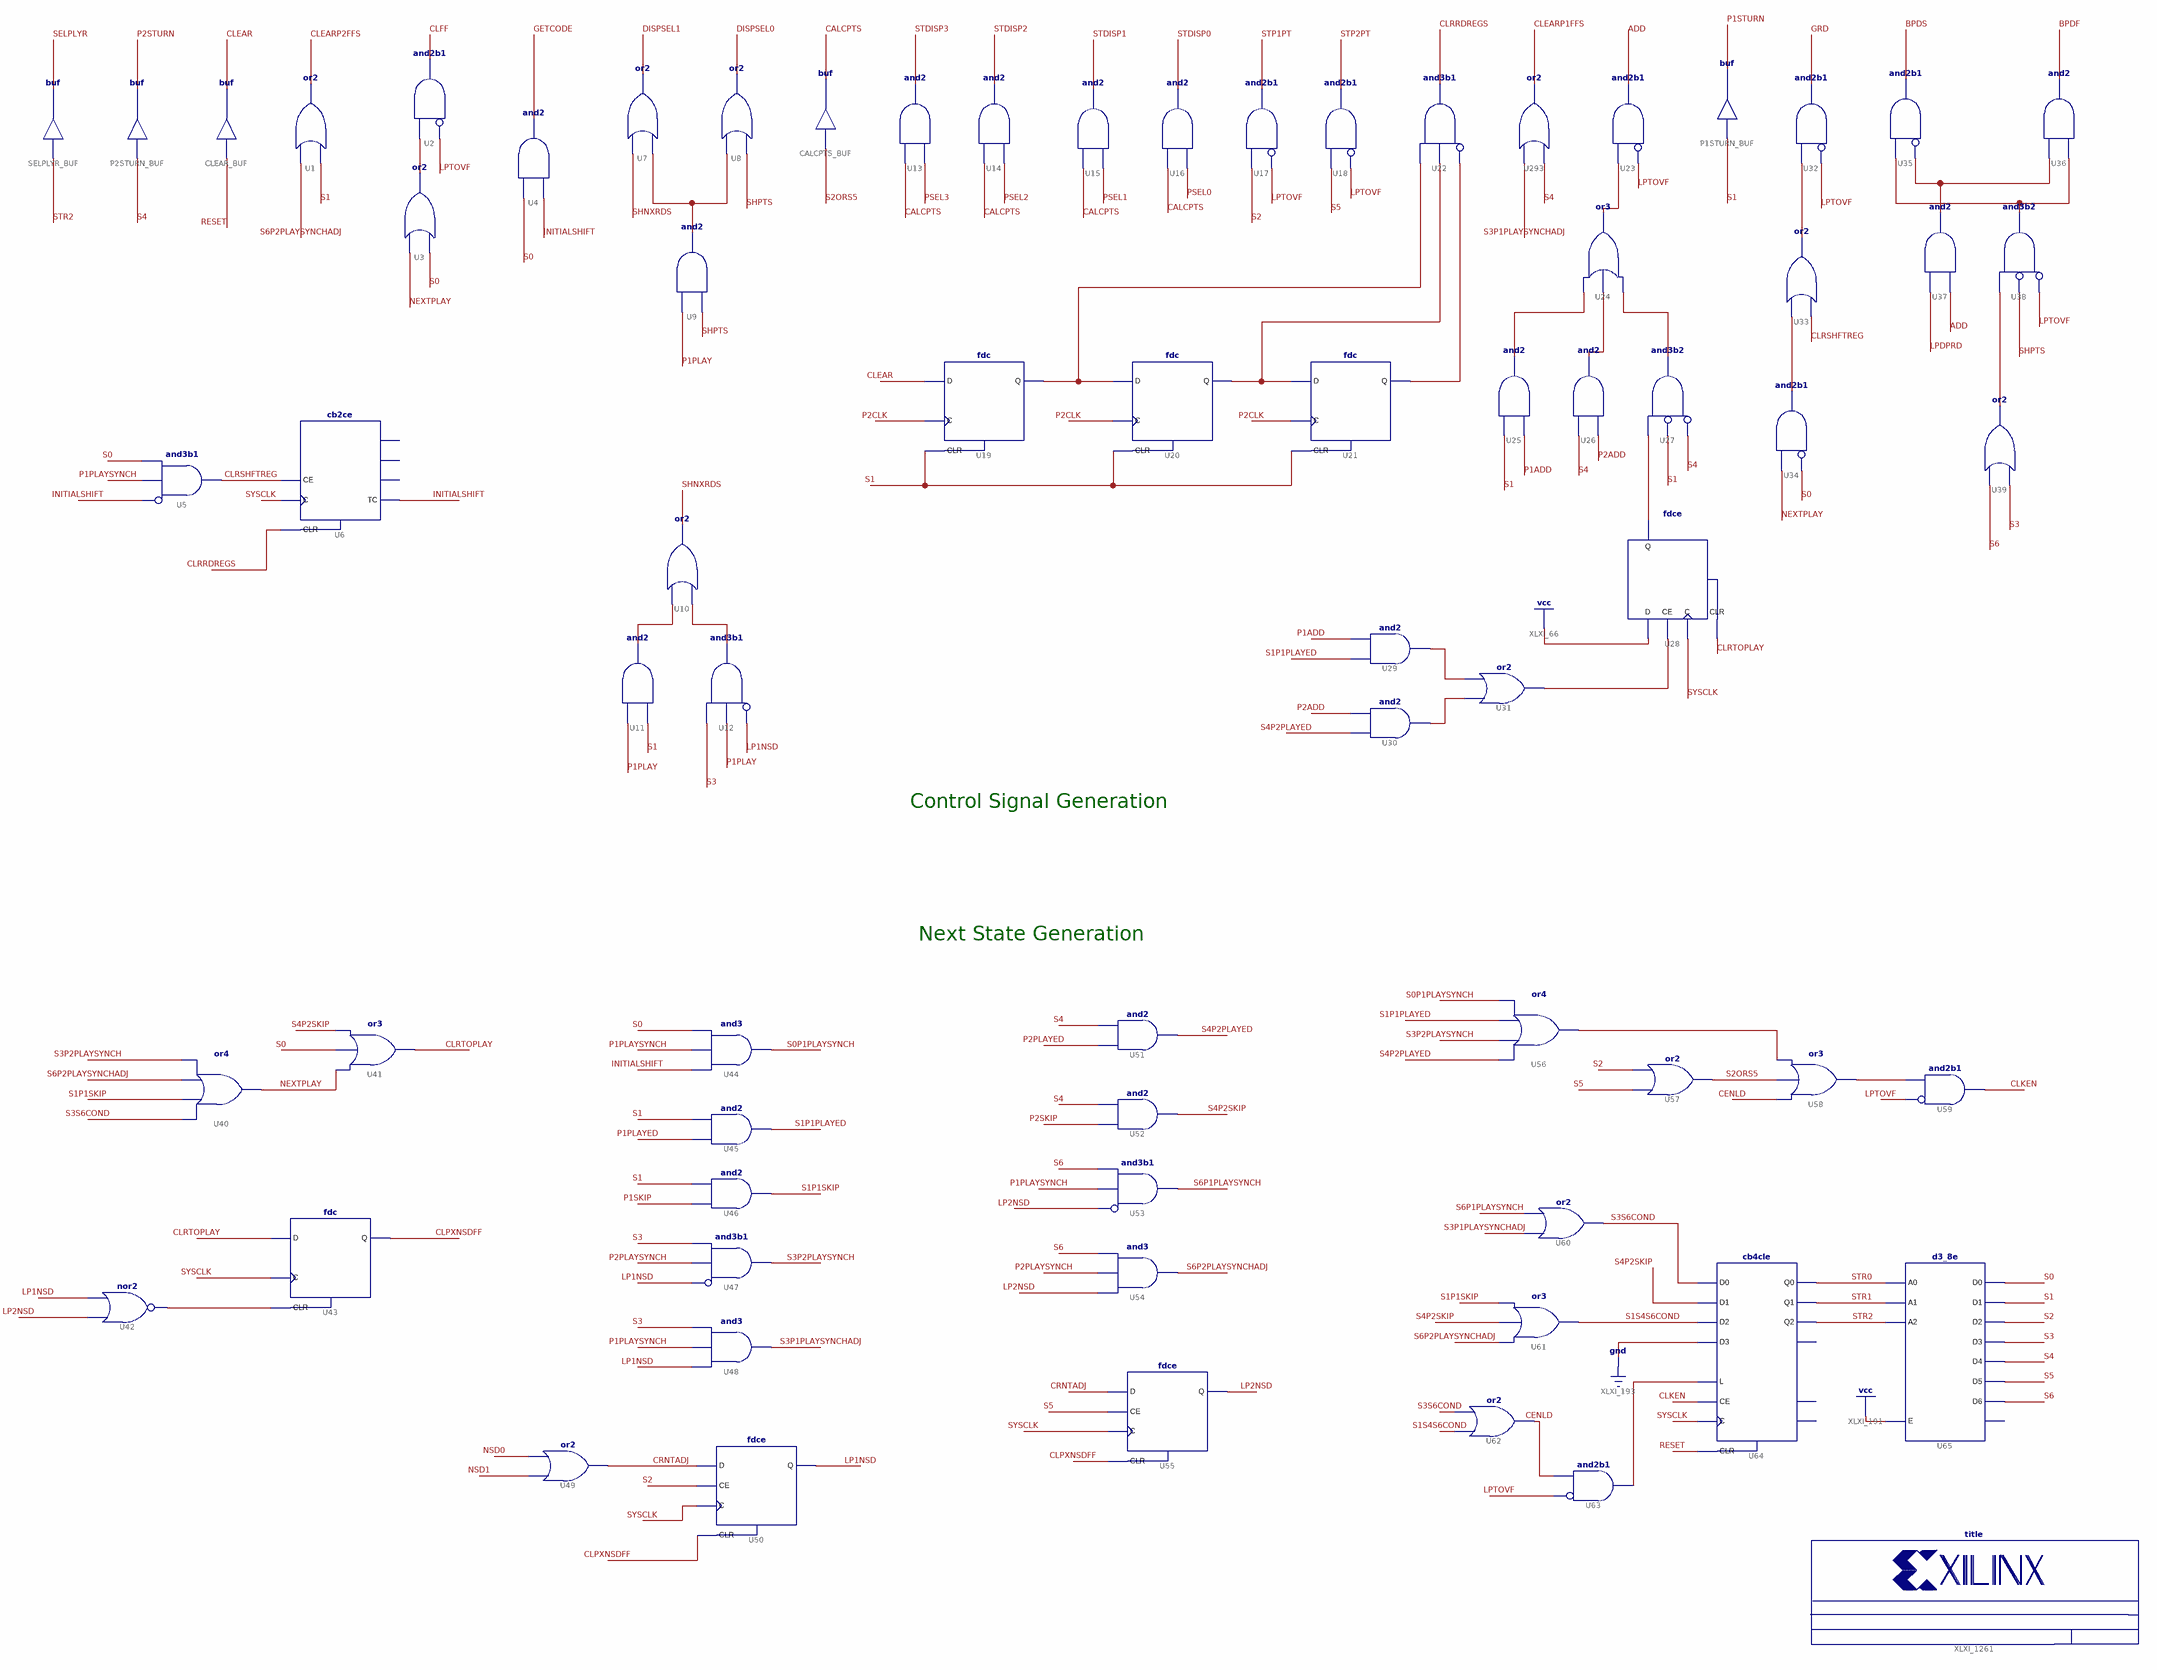
[diagram p0: schematic sheet 1]
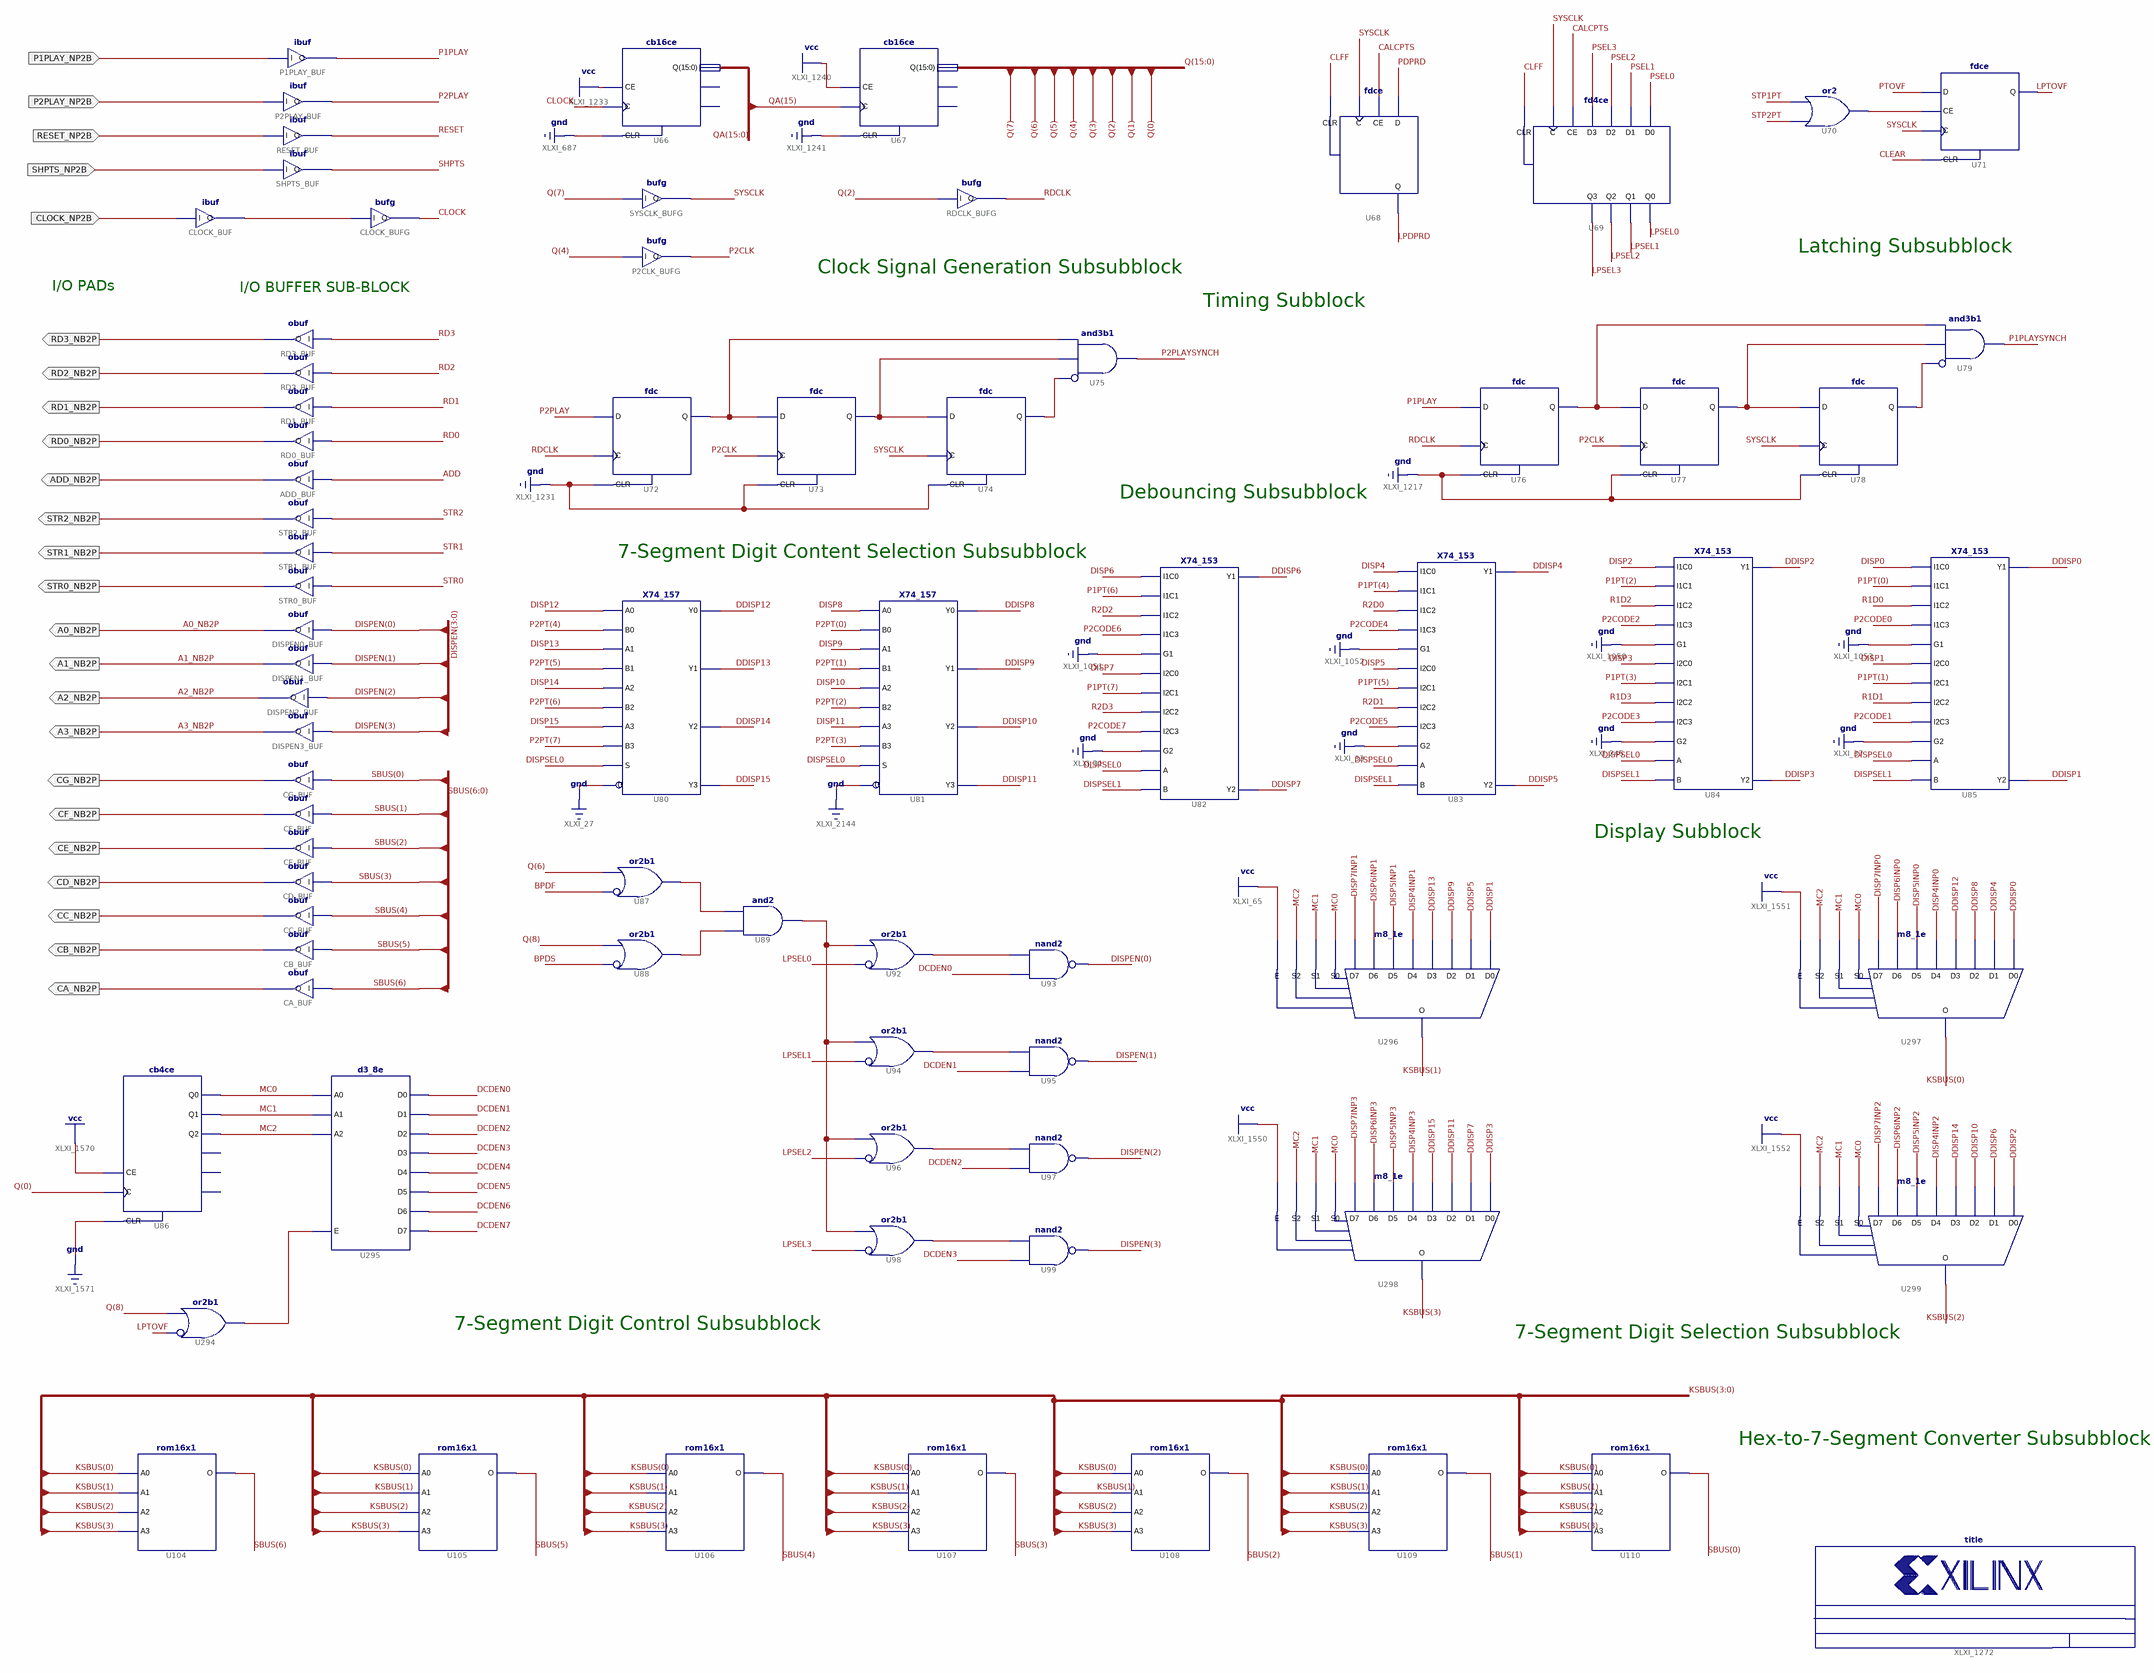
[diagram p1: schematic sheet 2]
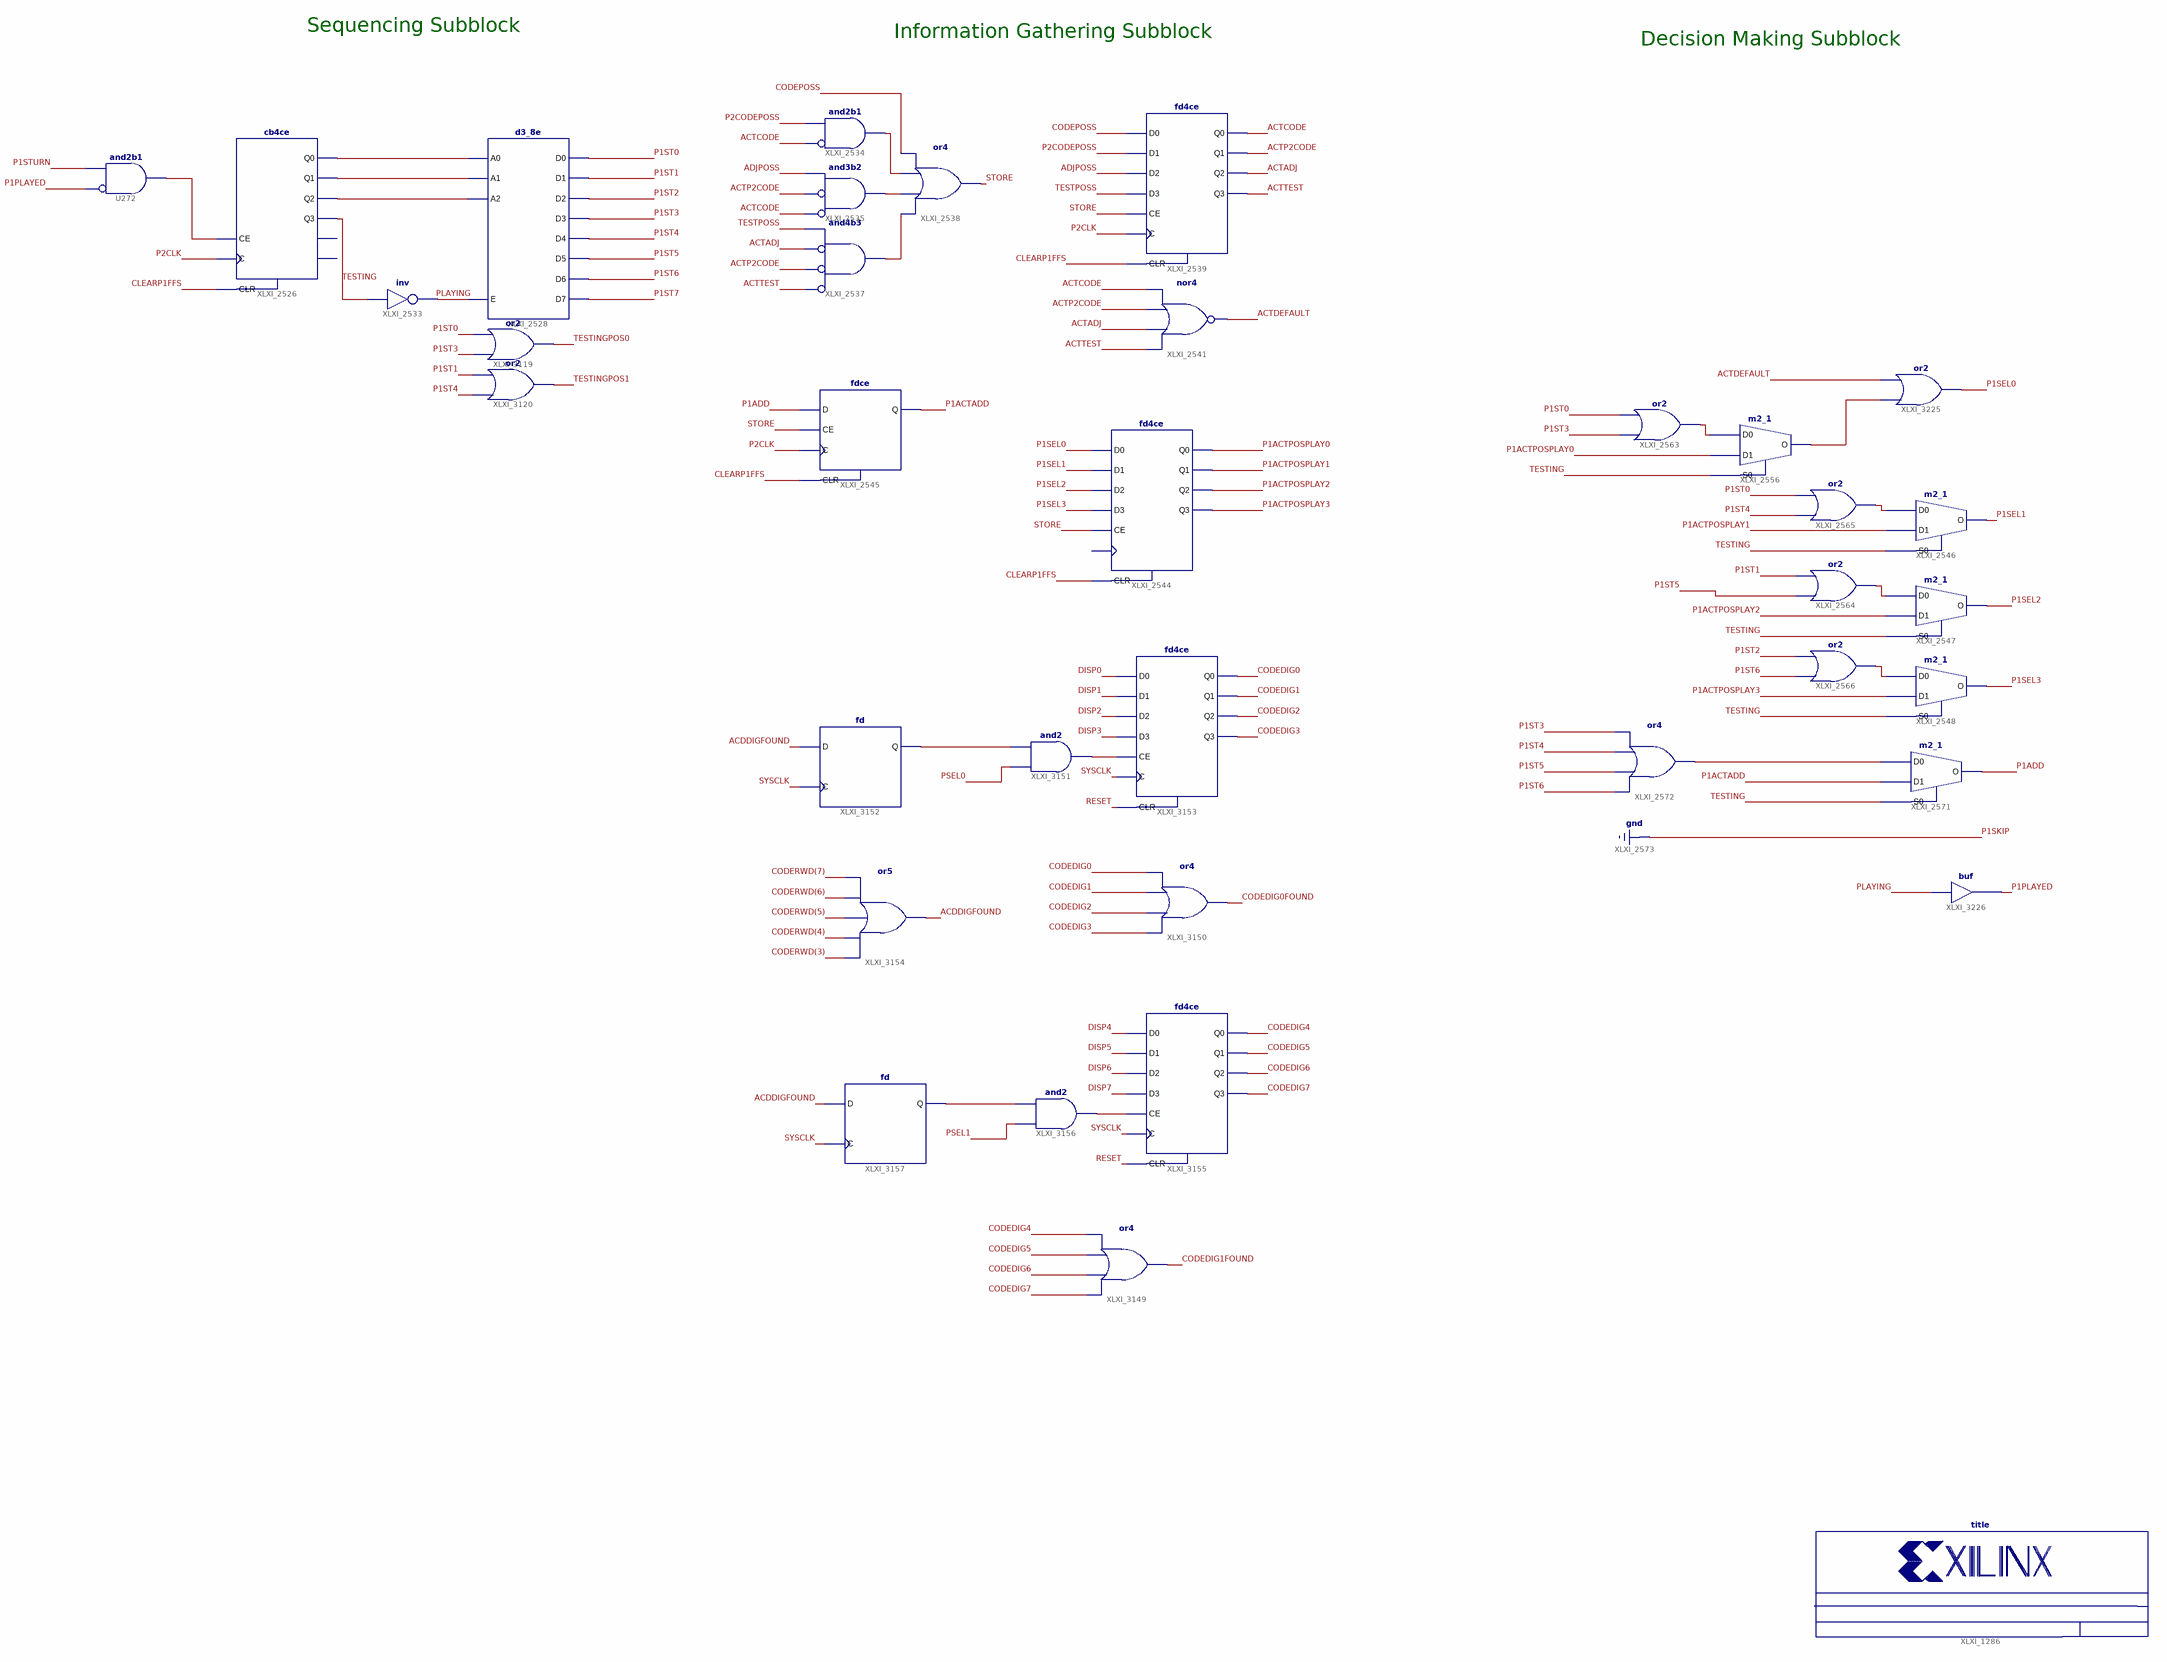
[diagram p2: schematic sheet 3]
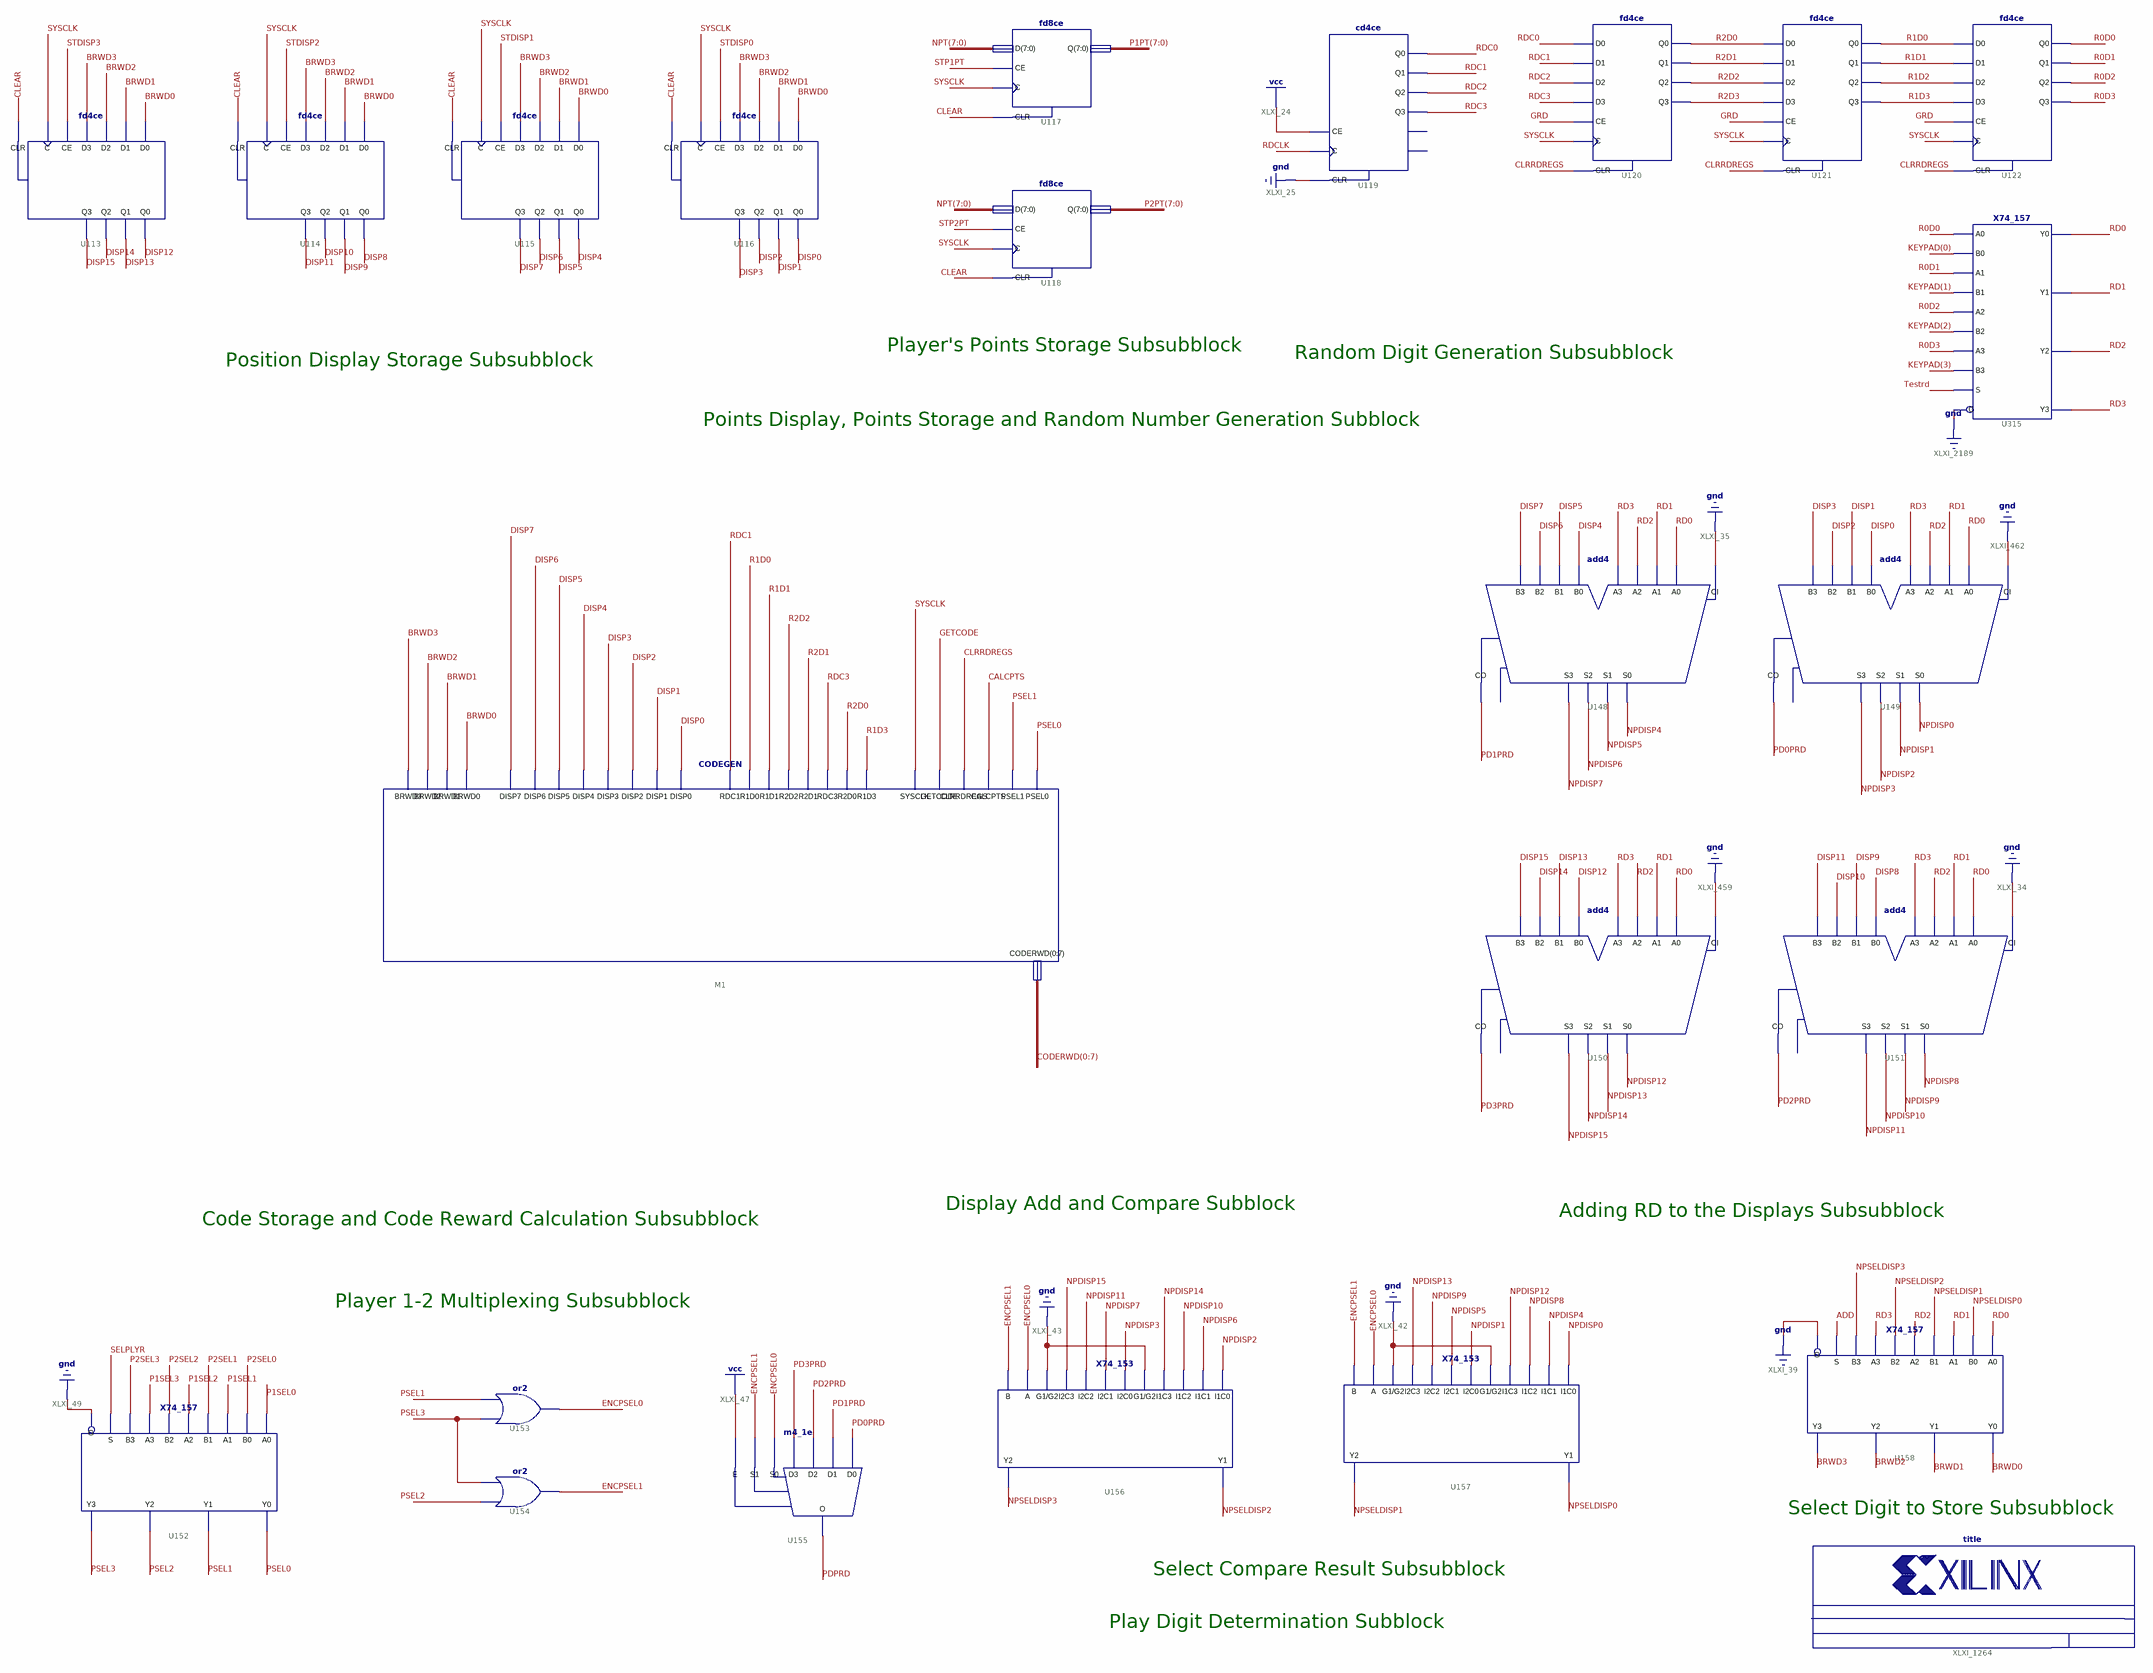
[diagram p3: schematic sheet 4]
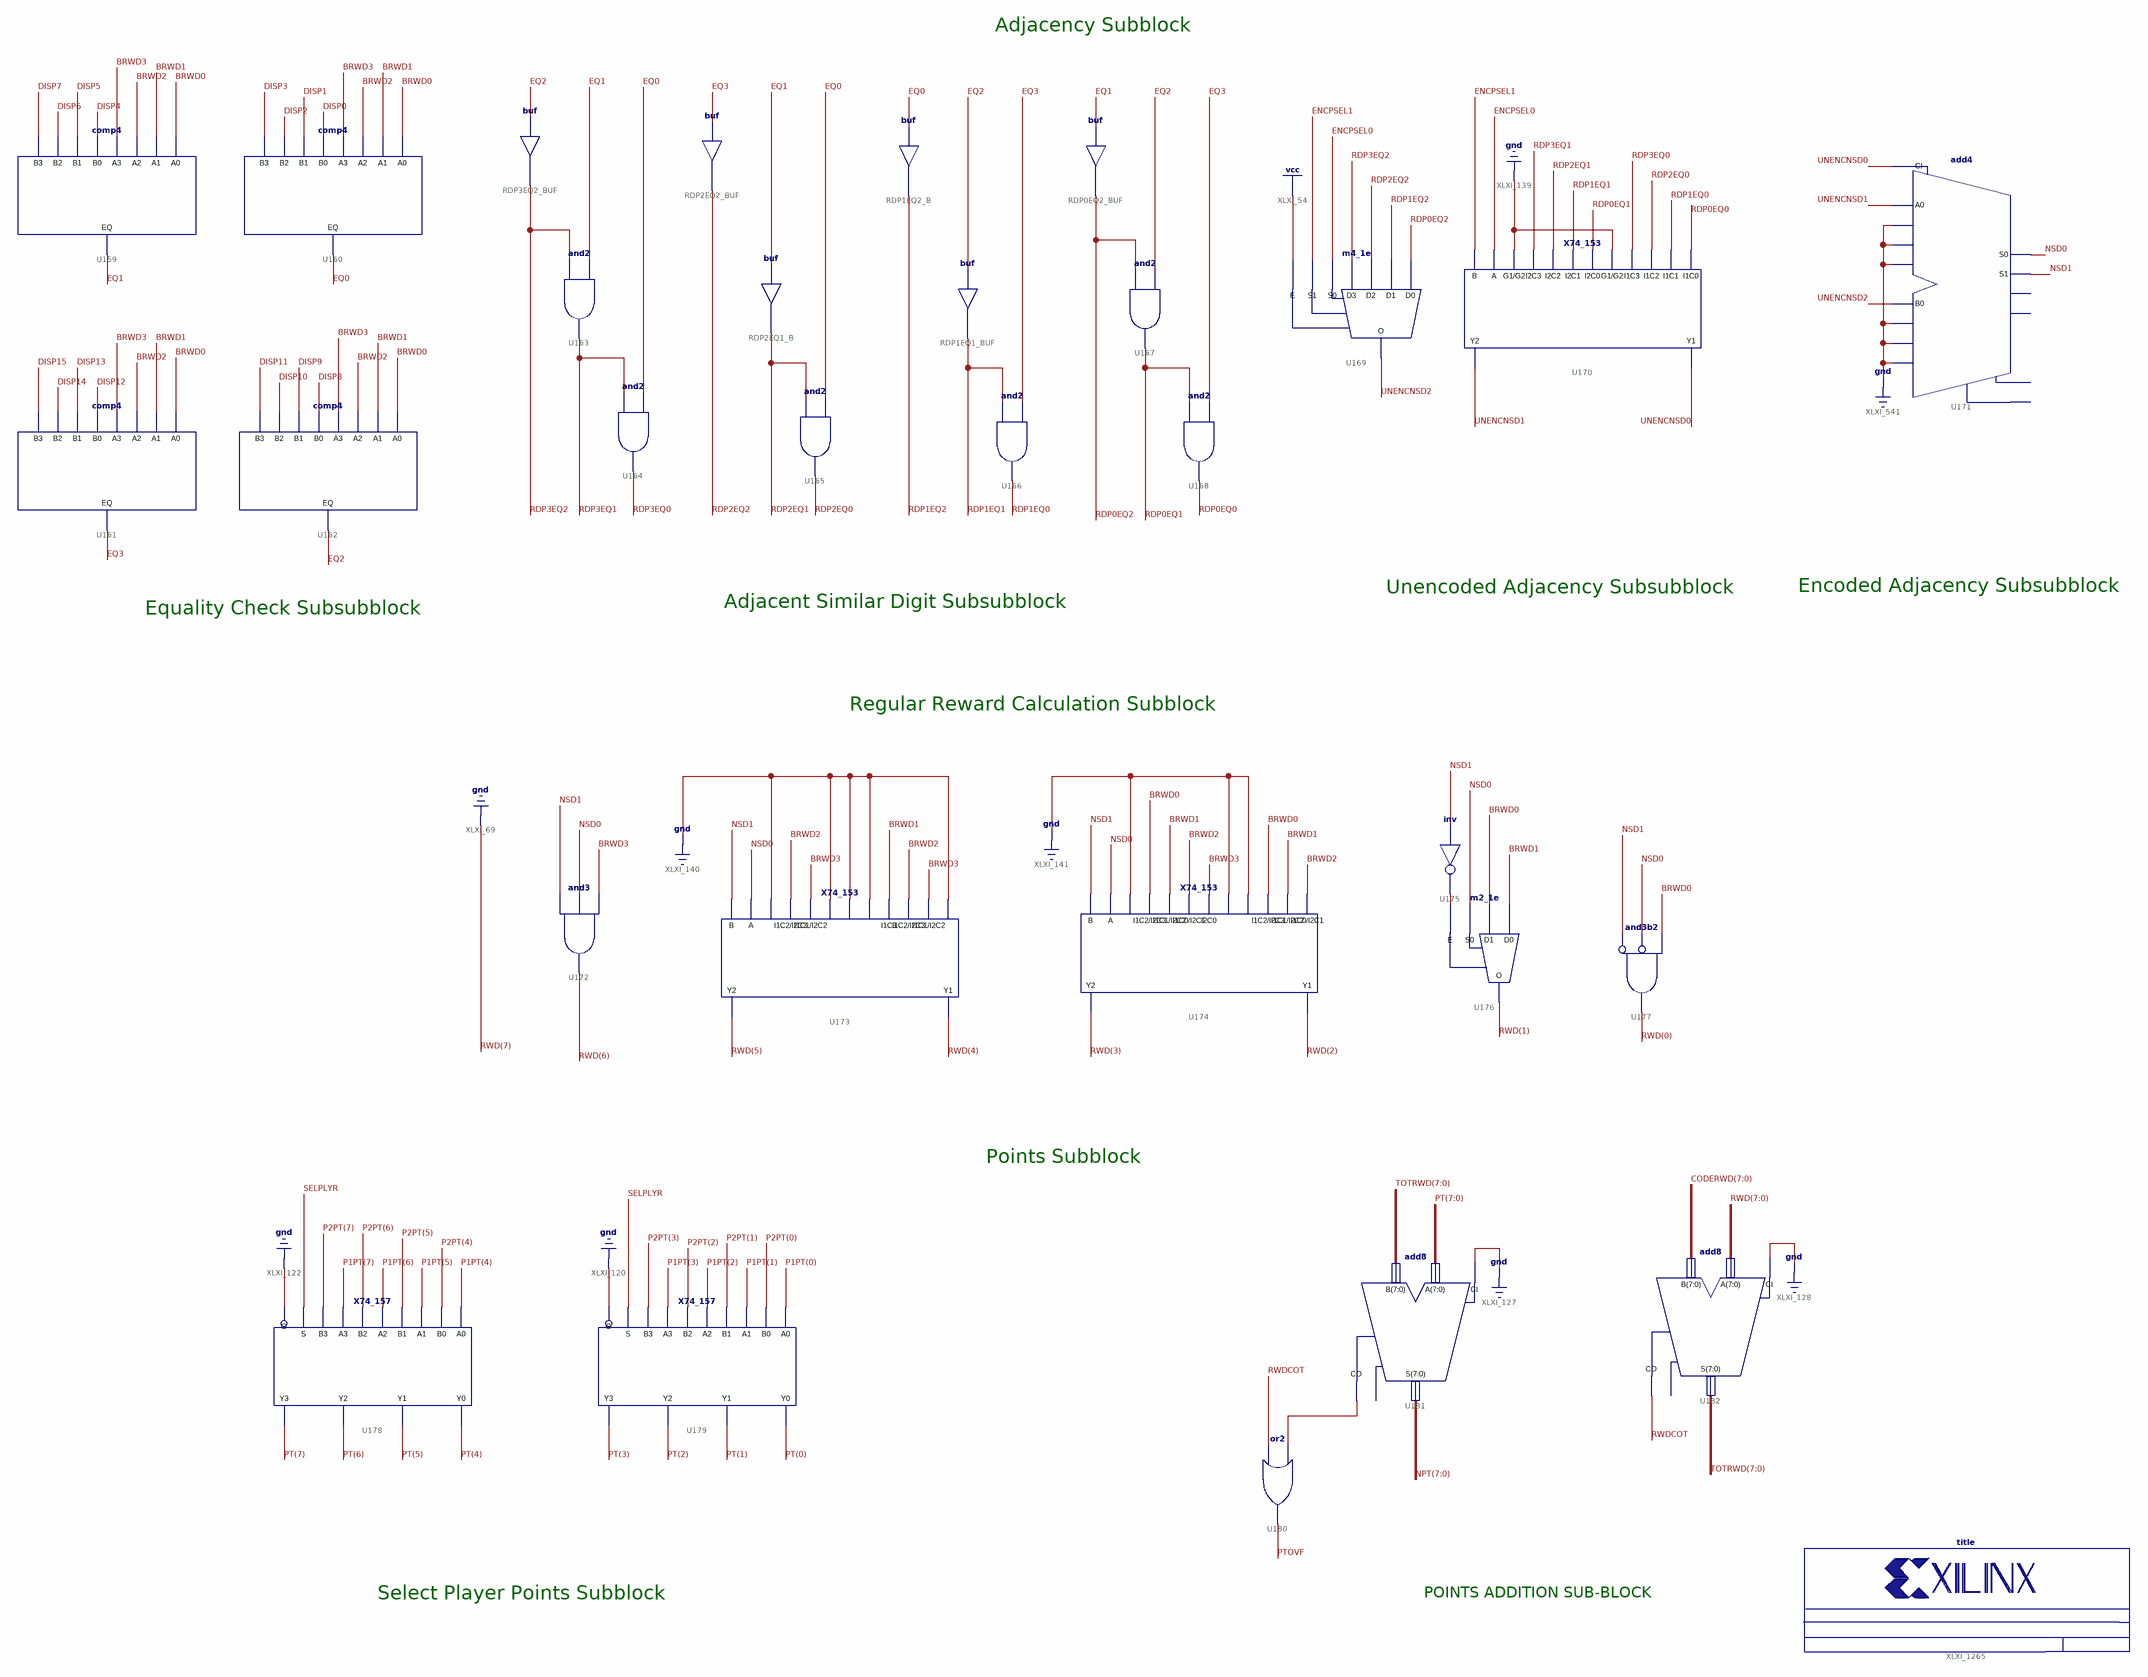
[diagram p4: schematic sheet 5]
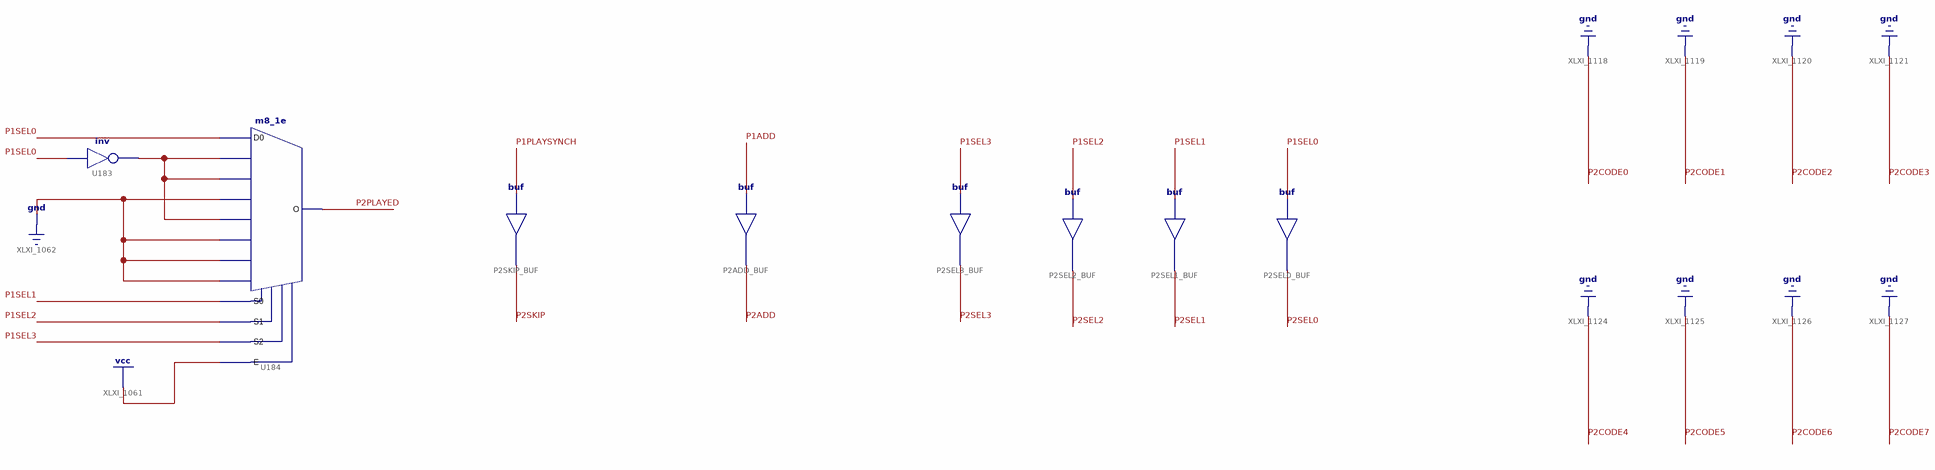
[diagram p5: schematic sheet 6]
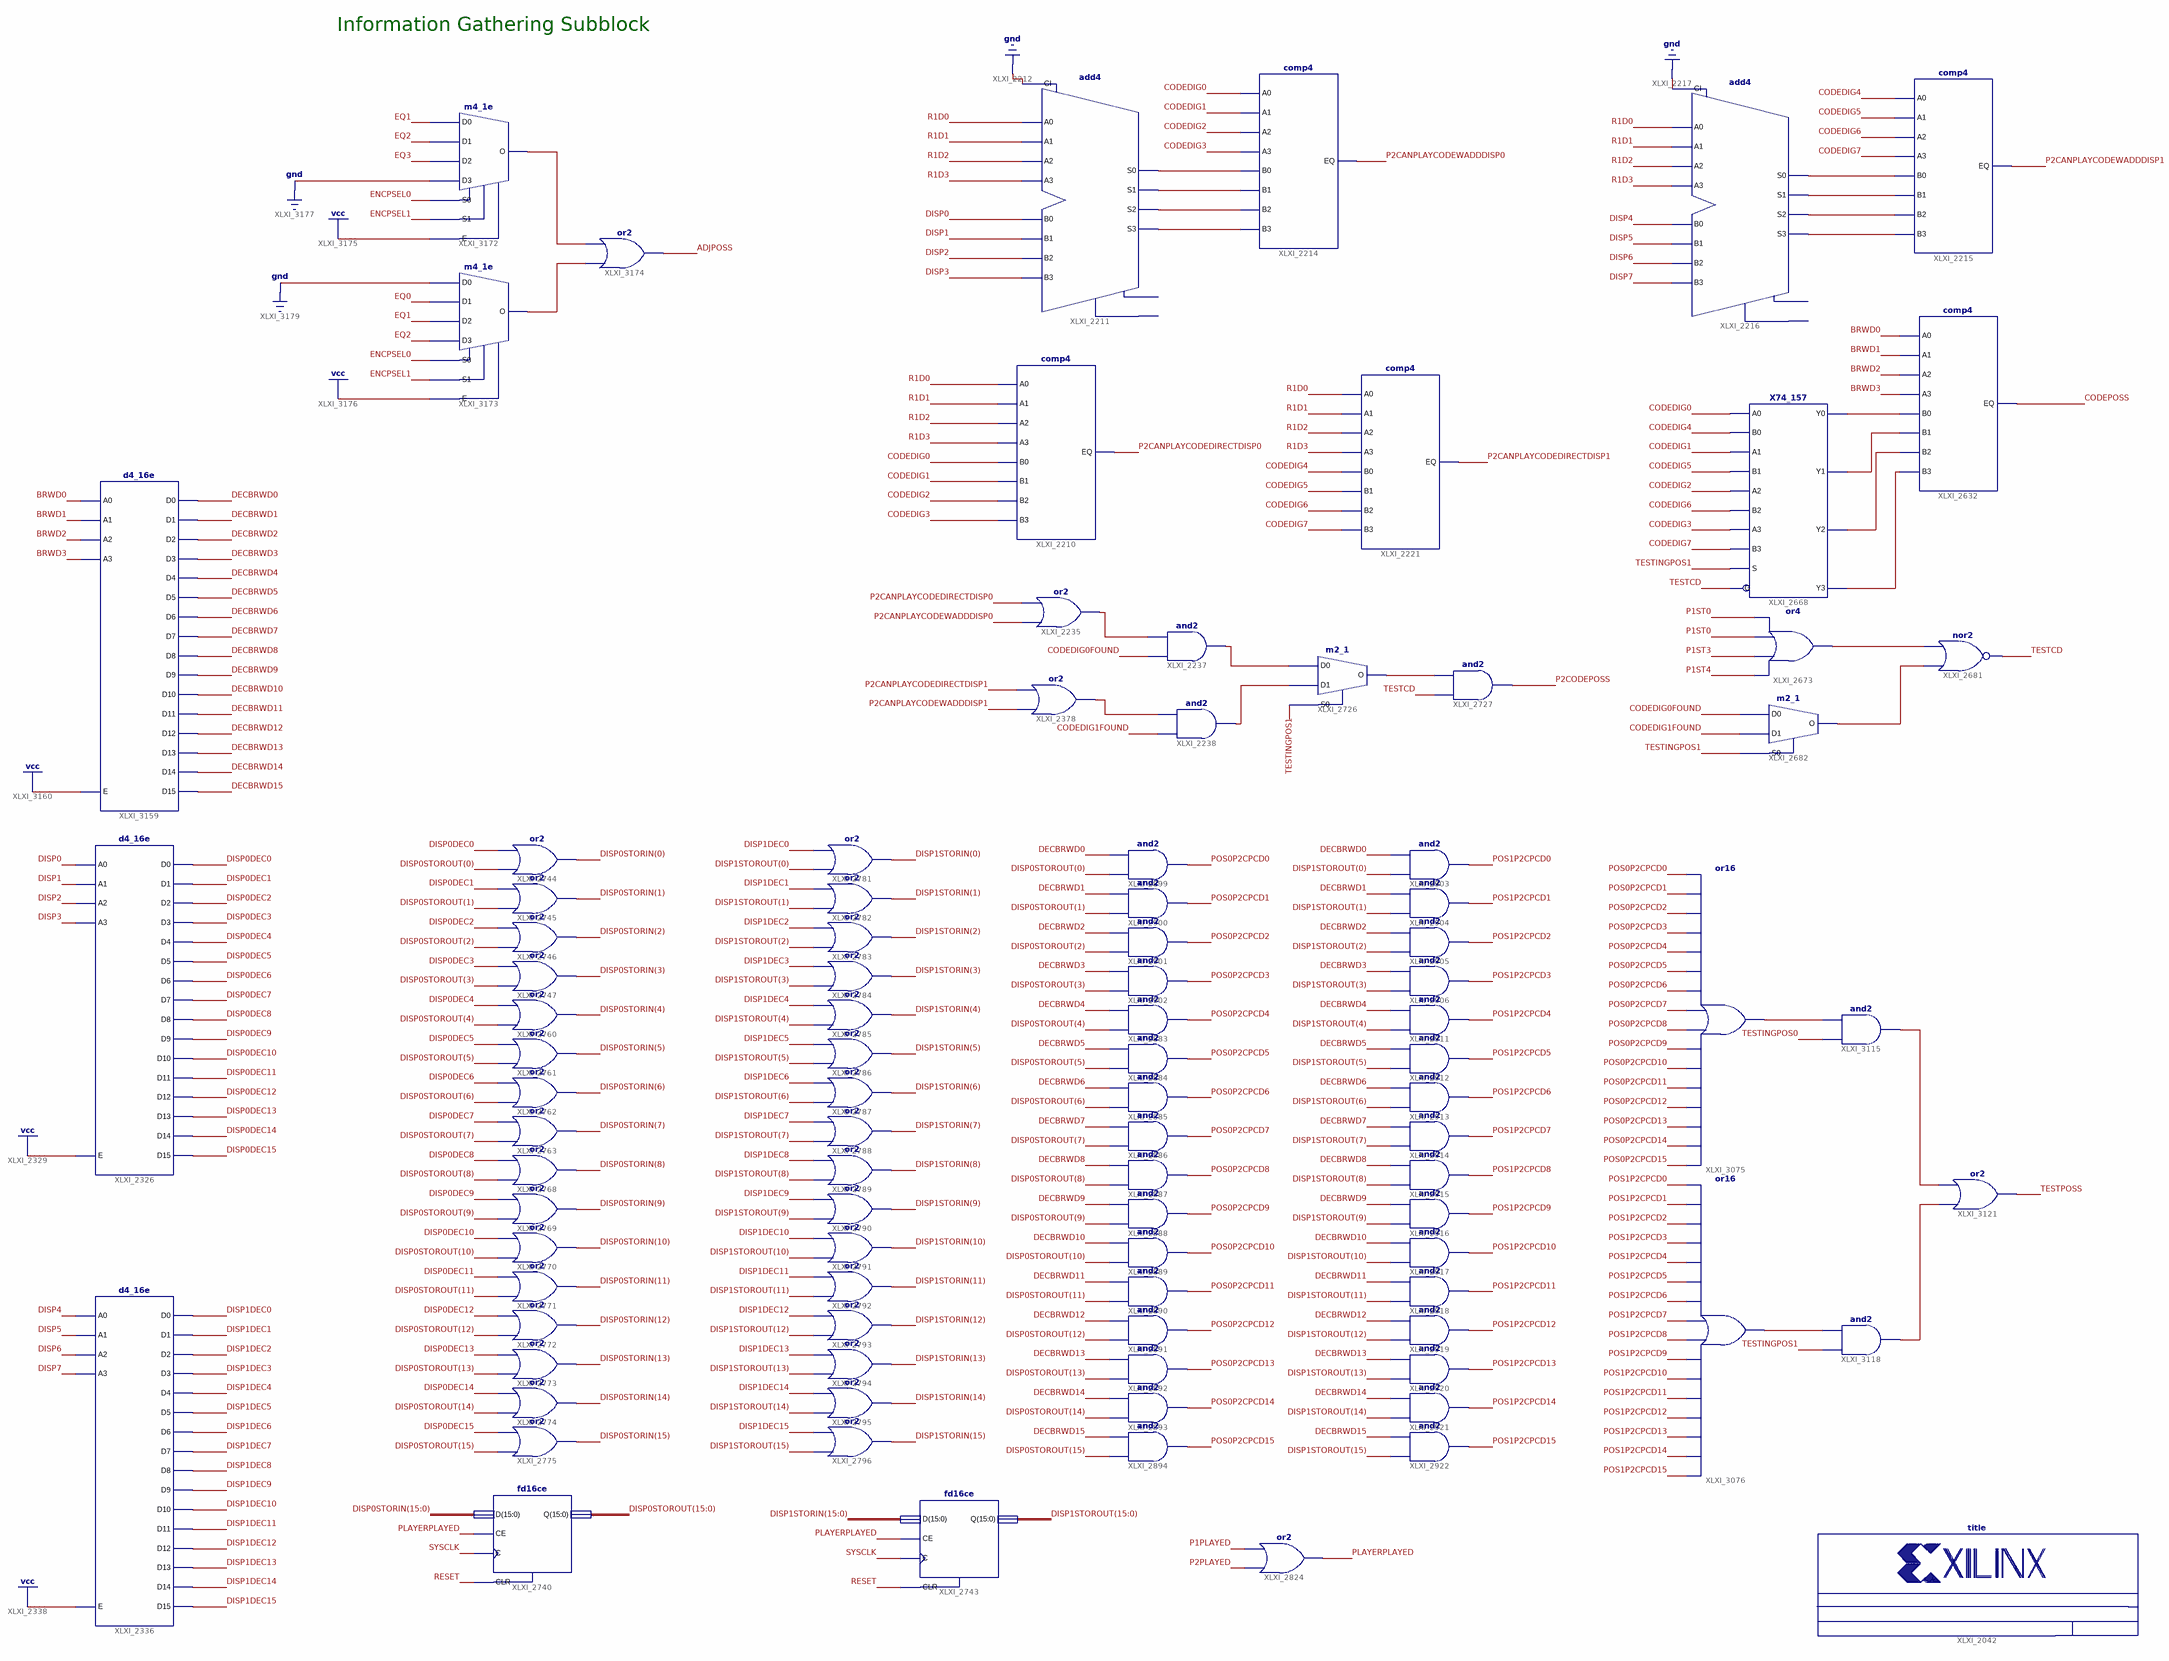
[diagram p6: schematic sheet 7]
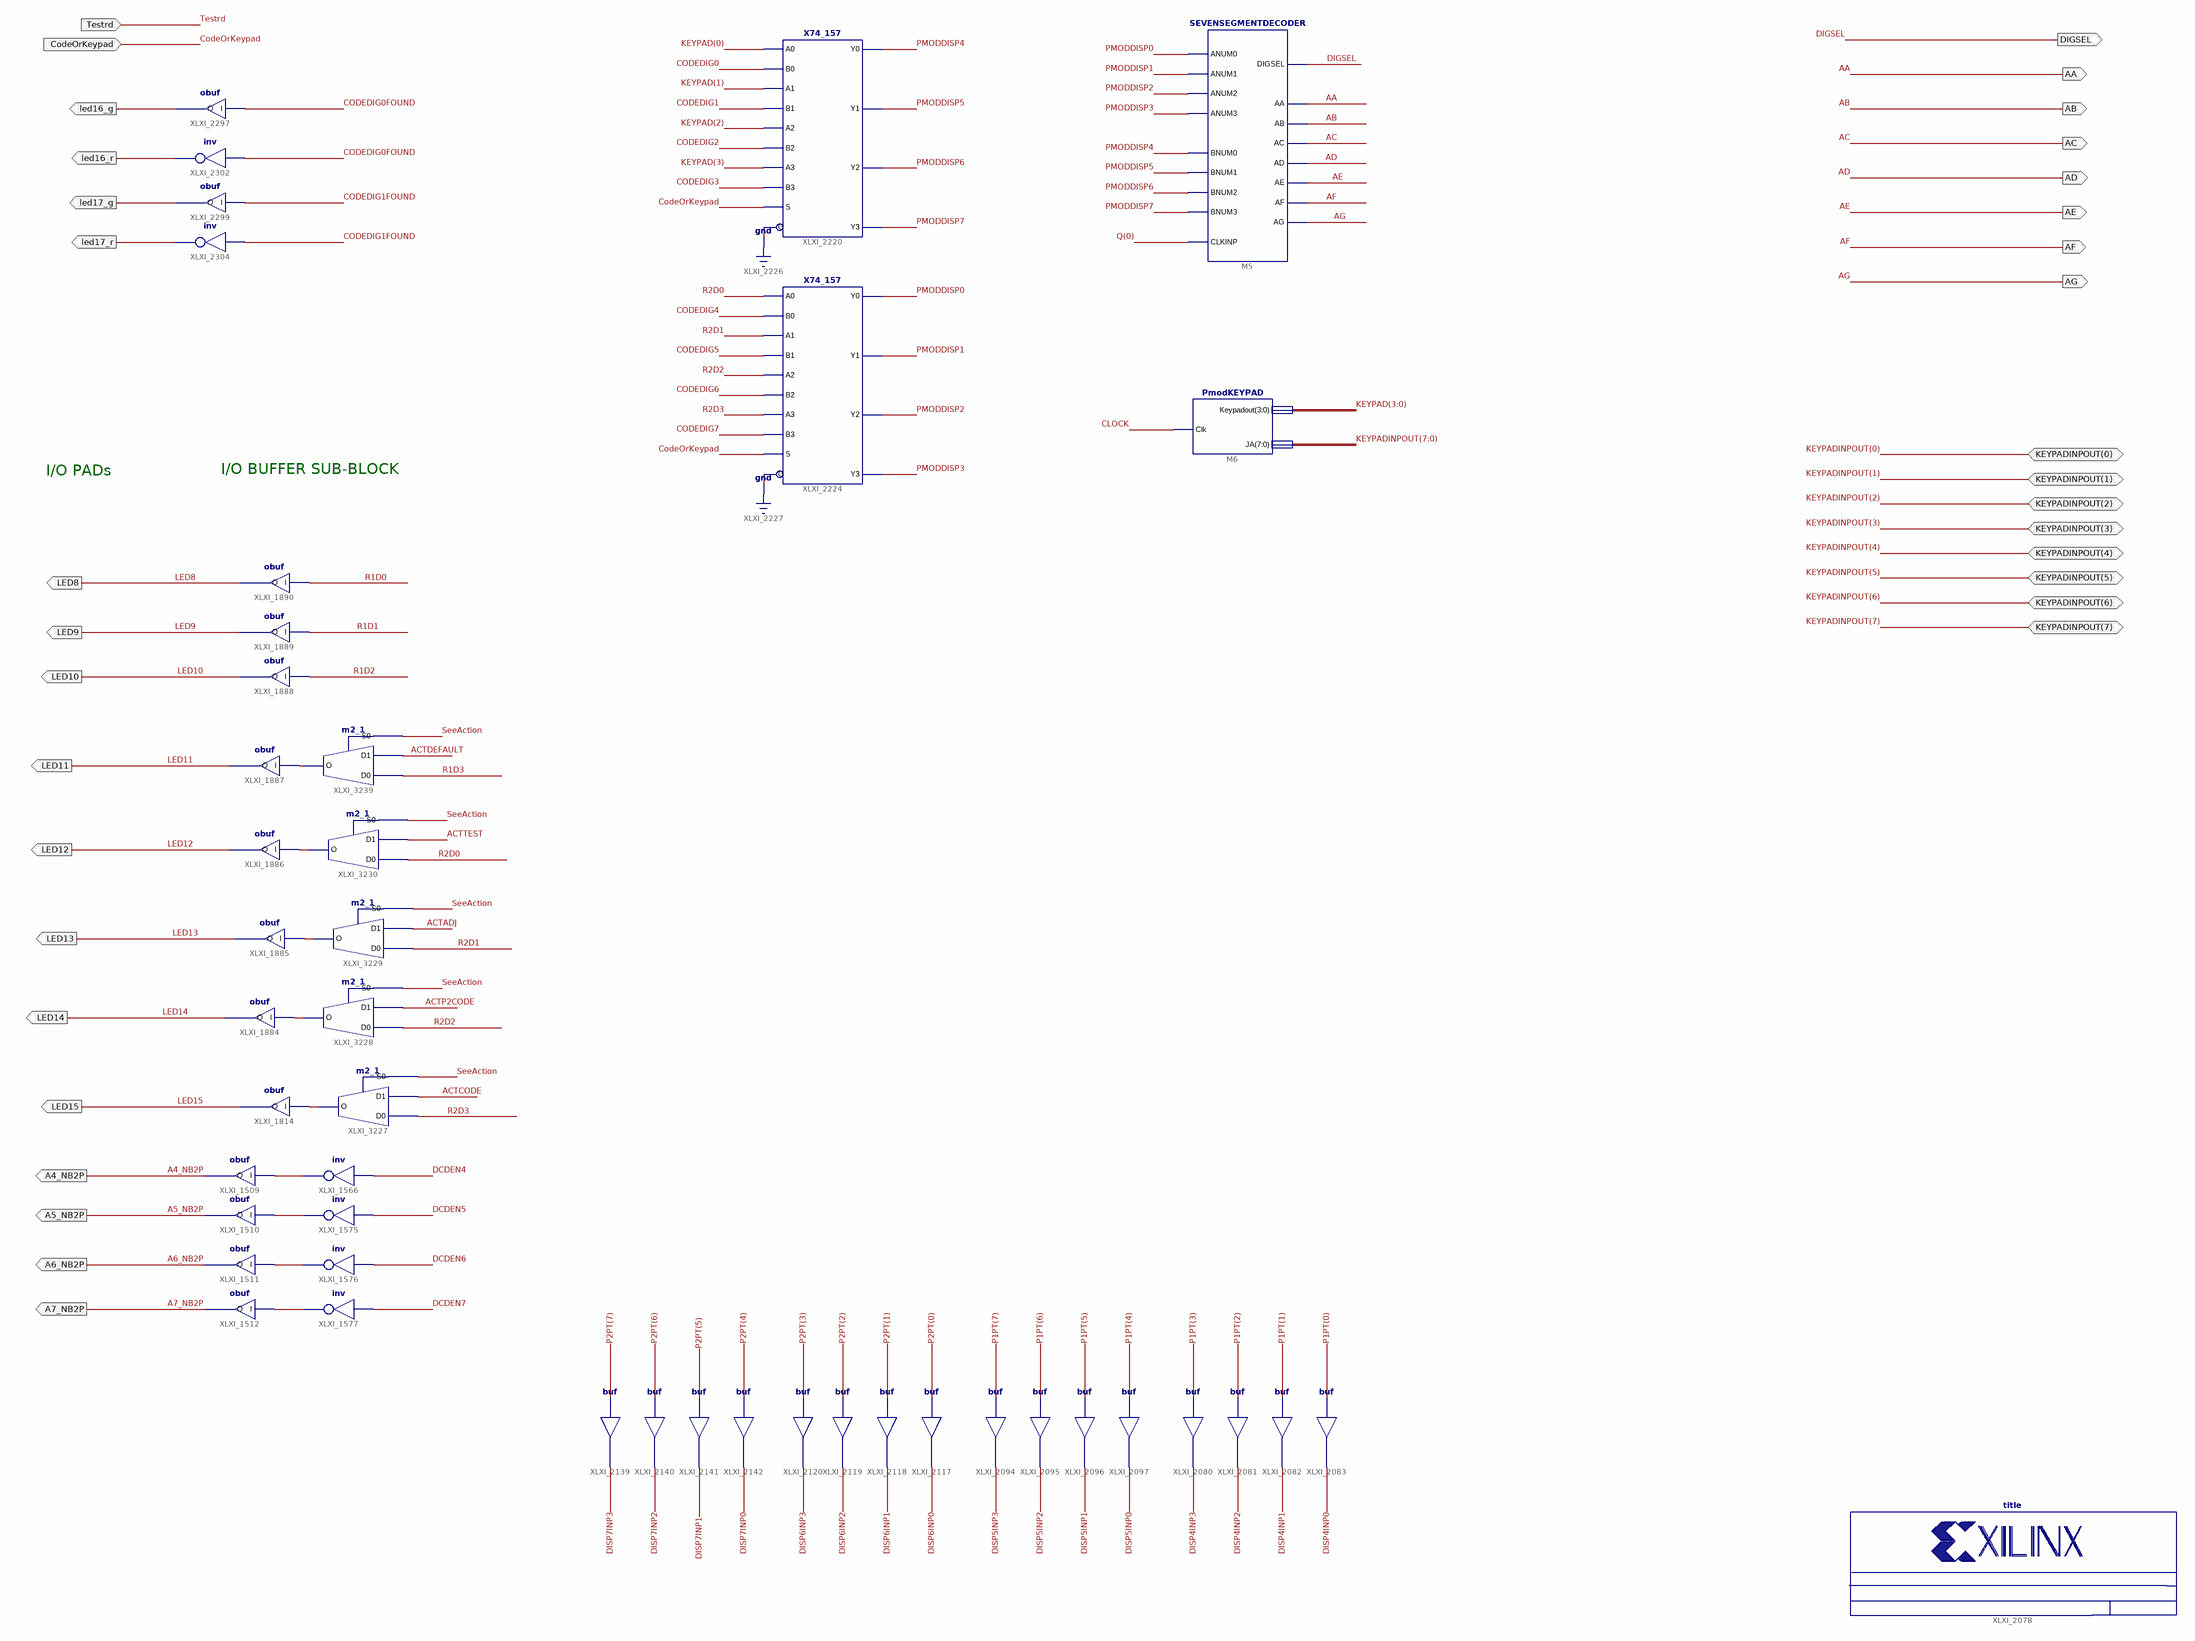
[diagram p7: schematic sheet 8]
// Xilinx ISE schematic ZACH12_13ppmmvsh.sch (artix7) as structural Verilog: 387 symbols, 58 ports
module ZACH12_13ppmmvsh (
  input  P1PLAY_NP2B,
  input  RESET_NP2B,
  input  SHPTS_NP2B,
  input  CLOCK_NP2B,
  input  P2PLAY_NP2B,
  input  Testrd,
  input  CodeOrKeypad,
  inout  [7:0] KEYPADINPOUT,
  output RD3_NB2P,
  output RD2_NB2P,
  output RD1_NB2P,
  output RD0_NB2P,
  output ADD_NB2P,
  output STR2_NB2P,
  output STR1_NB2P,
  output STR0_NB2P,
  output CG_NB2P,
  output CF_NB2P,
  output CE_NB2P,
  output CD_NB2P,
  output CC_NB2P,
  output CB_NB2P,
  output CA_NB2P,
  output A0_NB2P,
  output A1_NB2P,
  output A2_NB2P,
  output A3_NB2P,
  output LED15,
  output A4_NB2P,
  output A5_NB2P,
  output A6_NB2P,
  output A7_NB2P,
  output AA,
  output AB,
  output AC,
  output AD,
  output AE,
  output AF,
  output AG,
  output DIGSEL,
  output led16_g,
  output led17_r,
  output led17_g,
  output led16_r,
  output LED10,
  output LED9,
  output LED8,
  output LED11,
  output LED12,
  output LED13,
  output LED14
);

  wire ACDDIGFOUND, ACTADJ, ACTCODE, ACTDEFAULT, ACTP2CODE, ACTTEST, ADD, ADJPOSS, BPDF, BPDS, BRWD0, BRWD1,
       BRWD2, BRWD3, CALCPTS, CENLD, CLEAR, CLEARP1FFS, CLEARP2FFS, CLFF, CLKEN, CLOCK, CLPXNSDFF, CLRRDREGS,
       CLRSHFTREG, CLRTOPLAY, CODEDIG0, CODEDIG0FOUND, CODEDIG1, CODEDIG1FOUND, CODEDIG2, CODEDIG3, CODEDIG4,
       CODEDIG5, CODEDIG6, CODEDIG7, CODEPOSS, CRNTADJ, DCDEN0, DCDEN1, DCDEN2, DCDEN3, DCDEN4, DCDEN5,
       DCDEN6, DCDEN7, DDISP0, DDISP1, DDISP2, DDISP3, DDISP4, DDISP5, DDISP6, DDISP7, DDISP8, DDISP9,
       DDISP10, DDISP11, DDISP12, DDISP13, DDISP14, DDISP15, DECBRWD0, DECBRWD1, DECBRWD2, DECBRWD3,
       DECBRWD4, DECBRWD5, DECBRWD6, DECBRWD7, DECBRWD8, DECBRWD9, DECBRWD10, DECBRWD11, DECBRWD12,
       DECBRWD13, DECBRWD14, DECBRWD15, DISP0, DISP0DEC0, DISP0DEC1, DISP0DEC2, DISP0DEC3, DISP0DEC4,
       DISP0DEC5, DISP0DEC6, DISP0DEC7, DISP0DEC8, DISP0DEC9, DISP0DEC10, DISP0DEC11, DISP0DEC12, DISP0DEC13,
       DISP0DEC14, DISP0DEC15, DISP1, DISP1DEC0, DISP1DEC1, DISP1DEC2, DISP1DEC3, DISP1DEC4, DISP1DEC5,
       DISP1DEC6, DISP1DEC7, DISP1DEC8, DISP1DEC9, DISP1DEC10, DISP1DEC11, DISP1DEC12, DISP1DEC13,
       DISP1DEC14, DISP1DEC15, DISP2, DISP3, DISP4, DISP4INP0, DISP4INP1, DISP4INP2, DISP4INP3, DISP5,
       DISP5INP0, DISP5INP1, DISP5INP2, DISP5INP3, DISP6, DISP6INP0, DISP6INP1, DISP6INP2, DISP6INP3, DISP7,
       DISP7INP0, DISP7INP1, DISP7INP2, DISP7INP3, DISP8, DISP9, DISP10, DISP11, DISP12, DISP13, DISP14,
       DISP15, DISPSEL0, DISPSEL1, ENCPSEL0, ENCPSEL1, EQ0, EQ1, EQ2, EQ3, GETCODE, GRD, INITIALSHIFT,
       INT_NET0, INT_NET1, INT_NET2, INT_NET6, INT_NET8, INT_NET10, INT_NET11, LP1NSD, LP2NSD, LPDPRD,
       LPSEL0, LPSEL1, LPSEL2, LPSEL3, LPTOVF, MC0, MC1, MC2, NEXTPLAY, NPDISP0, NPDISP1, NPDISP2, NPDISP3,
       NPDISP4, NPDISP5, NPDISP6, NPDISP7, NPDISP8, NPDISP9, NPDISP10, NPDISP11, NPDISP12, NPDISP13,
       NPDISP14, NPDISP15, NPSELDISP0, NPSELDISP1, NPSELDISP2, NPSELDISP3, NSD0, NSD1, P1ACTADD,
       P1ACTPOSPLAY0, P1ACTPOSPLAY1, P1ACTPOSPLAY2, P1ACTPOSPLAY3, P1ADD, P1PLAY, P1PLAYED, P1PLAYSYNCH,
       P1SEL0, P1SEL1, P1SEL2, P1SEL3, P1ST0, P1ST1, P1ST2, P1ST3, P1ST4, P1ST5, P1ST6, P1ST7, P1STURN,
       P2ADD, P2CANPLAYCODEDIRECTDISP0, P2CANPLAYCODEDIRECTDISP1, P2CANPLAYCODEWADDDISP0,
       P2CANPLAYCODEWADDDISP1, P2CLK, P2CODEPOSS, P2PLAY, P2PLAYED, P2PLAYSYNCH, P2SEL0, P2SEL1, P2SEL2,
       P2SEL3, P2SKIP, P2STURN, PD0PRD, PD1PRD, PD2PRD, PD3PRD, PDPRD, PLAYERPLAYED, PLAYING, PMODDISP0,
       PMODDISP1, PMODDISP2, PMODDISP3, PMODDISP4, PMODDISP5, PMODDISP6, PMODDISP7, POS0P2CPCD0, POS0P2CPCD1,
       POS0P2CPCD2, POS0P2CPCD3, POS0P2CPCD4, POS0P2CPCD5, POS0P2CPCD6, POS0P2CPCD7, POS0P2CPCD8,
       POS0P2CPCD9, POS0P2CPCD10, POS0P2CPCD11, POS0P2CPCD12, POS0P2CPCD13, POS0P2CPCD14, POS0P2CPCD15,
       POS1P2CPCD0, POS1P2CPCD1, POS1P2CPCD2, POS1P2CPCD3, POS1P2CPCD4, POS1P2CPCD5, POS1P2CPCD6,
       POS1P2CPCD7, POS1P2CPCD8, POS1P2CPCD9, POS1P2CPCD10, POS1P2CPCD11, POS1P2CPCD12, POS1P2CPCD13,
       POS1P2CPCD14, POS1P2CPCD15, PSEL0, PSEL1, PSEL2, PSEL3, PTOVF, R0D0, R0D1, R0D2, R0D3, R1D0, R1D1,
       R1D2, R1D3, R2D0, R2D1, R2D2, R2D3, RD0, RD1, RD2, RD3, RDC0, RDC1, RDC2, RDC3, RDCLK, RDP0EQ0,
       RDP0EQ1, RDP0EQ2, RDP1EQ0, RDP1EQ1, RDP1EQ2, RDP2EQ0, RDP2EQ1, RDP2EQ2, RDP3EQ0, RDP3EQ1, RDP3EQ2,
       RESET, RWDCOT, S0, S0P1PLAYSYNCH, S1, S1P1PLAYED, S1P1SKIP, S1S4S6COND, S2, S2ORS5, S3,
       S3P1PLAYSYNCHADJ, S3P2PLAYSYNCH, S3S6COND, S4, S4P2PLAYED, S4P2SKIP, S5, S6, S6P1PLAYSYNCH,
       S6P2PLAYSYNCHADJ, SeeAction, SELPLYR, SHNXRDS, SHPTS, STDISP0, STDISP1, STDISP2, STDISP3, STORE,
       STP1PT, STP2PT, STR0, STR1, STR2, SYSCLK, TESTCD, TESTING, TESTINGPOS0, TESTINGPOS1, TESTPOSS,
       UNENCNSD0, UNENCNSD1, UNENCNSD2, XLXN_74, XLXN_181, XLXN_193, XLXN_194, XLXN_195, XLXN_202, XLXN_203,
       XLXN_210, XLXN_1764, XLXN_1802, XLXN_2370, XLXN_10482, XLXN_10484, XLXN_10495, XLXN_10958, XLXN_10960,
       XLXN_10962, XLXN_11863, XLXN_12041, XLXN_12042, XLXN_12043, XLXN_12049, XLXN_12058, XLXN_12173,
       XLXN_12199, XLXN_12205, XLXN_12212, XLXN_12213, XLXN_12236, XLXN_12237, XLXN_12247, XLXN_12248,
       XLXN_12257, XLXN_12297, XLXN_12299, XLXN_12324, XLXN_12325, XLXN_12333, XLXN_12334, XLXN_12335,
       XLXN_12343, XLXN_12843, XLXN_12844, XLXN_12845, XLXN_12846, XLXN_12854, XLXN_12855, XLXN_12856,
       XLXN_12857, XLXN_12935, XLXN_12940, XLXN_12976, XLXN_12990, XLXN_13194, XLXN_13219, XLXN_14083,
       XLXN_14084, XLXN_14085, XLXN_14166, XLXN_14167, XLXN_14168, XLXN_14271, XLXN_14272, XLXN_14273,
       XLXN_14274, XLXN_14275, XLXN_14728, XLXN_14729, XLXN_14730, XLXN_14731, XLXN_14765, XLXN_14766,
       XLXN_14959, XLXN_14960, XLXN_14972, XLXN_15904, XLXN_15908, XLXN_15917, XLXN_15918, XLXN_16325,
       XLXN_16326, XLXN_16486, XLXN_16496, XLXN_16508, XLXN_16510, XLXN_16511, XLXN_16512;
  wire [3:0] DISPEN, KEYPAD, KSBUS;
  wire [6:0] RWD, SBUS;
  wire [7:0] CODERWD, NPT, P1PT, P2PT, PT, TOTRWD;
  wire [15:0] DISP0STORIN, DISP0STOROUT, DISP1STORIN, DISP1STOROUT, Q, QA;

  X74_153 U85 (
    .I1C0(DISP0), .I1C1(P1PT[0]), .I1C2(R1D0), .I1C3(1'b0), .G1(1'b0), .I2C0(DISP1), .I2C1(P1PT[1]),
    .I2C2(R1D1), .I2C3(1'b0), .G2(1'b0), .A(DISPSEL0), .B(DISPSEL1), .Y1(DDISP0), .Y2(DDISP1));
  X74_153 U84 (
    .I1C0(DISP2), .I1C1(P1PT[2]), .I1C2(R1D2), .I1C3(1'b0), .G1(1'b0), .I2C0(DISP3), .I2C1(P1PT[3]),
    .I2C2(R1D3), .I2C3(1'b0), .G2(1'b0), .A(DISPSEL0), .B(DISPSEL1), .Y1(DDISP2), .Y2(DDISP3));
  X74_153 U83 (
    .I1C0(DISP4), .I1C1(P1PT[4]), .I1C2(R2D0), .I1C3(1'b0), .G1(1'b0), .I2C0(DISP5), .I2C1(P1PT[5]),
    .I2C2(R2D1), .I2C3(1'b0), .G2(1'b0), .A(DISPSEL0), .B(DISPSEL1), .Y1(DDISP4), .Y2(DDISP5));
  X74_153 U82 (
    .I1C0(DISP6), .I1C1(P1PT[6]), .I1C2(R2D2), .I1C3(1'b0), .G1(1'b0), .I2C0(DISP7), .I2C1(P1PT[7]),
    .I2C2(R2D3), .I2C3(1'b0), .G2(1'b0), .A(DISPSEL0), .B(DISPSEL1), .Y1(DDISP6), .Y2(DDISP7));
  rom16x1 #(.INIT("2812")) U104 (.A0(KSBUS[0]), .A1(KSBUS[1]), .A2(KSBUS[2]), .A3(KSBUS[3]), .O(SBUS[6]));
  rom16x1 #(.INIT("D860")) U105 (.A0(KSBUS[0]), .A1(KSBUS[1]), .A2(KSBUS[2]), .A3(KSBUS[3]), .O(SBUS[5]));
  rom16x1 #(.INIT("D004")) U106 (.A0(KSBUS[0]), .A1(KSBUS[1]), .A2(KSBUS[2]), .A3(KSBUS[3]), .O(SBUS[4]));
  rom16x1 #(.INIT("8692")) U107 (.A0(KSBUS[0]), .A1(KSBUS[1]), .A2(KSBUS[2]), .A3(KSBUS[3]), .O(SBUS[3]));
  rom16x1 #(.INIT("02BA")) U108 (.A0(KSBUS[0]), .A1(KSBUS[1]), .A2(KSBUS[2]), .A3(KSBUS[3]), .O(SBUS[2]));
  rom16x1 #(.INIT("208E")) U109 (.A0(KSBUS[0]), .A1(KSBUS[1]), .A2(KSBUS[2]), .A3(KSBUS[3]), .O(SBUS[1]));
  rom16x1 #(.INIT("1083")) U110 (.A0(KSBUS[0]), .A1(KSBUS[1]), .A2(KSBUS[2]), .A3(KSBUS[3]), .O(SBUS[0]));
  fd4ce U122 (
    .C(SYSCLK), .CE(GRD), .CLR(CLRRDREGS), .D0(R1D0), .D1(R1D1), .D2(R1D2), .D3(R1D3), .Q0(R0D0), .Q1(R0D1),
    .Q2(R0D2), .Q3(R0D3));
  fd4ce U121 (
    .C(SYSCLK), .CE(GRD), .CLR(CLRRDREGS), .D0(R2D0), .D1(R2D1), .D2(R2D2), .D3(R2D3), .Q0(R1D0), .Q1(R1D1),
    .Q2(R1D2), .Q3(R1D3));
  fd4ce U120 (
    .C(SYSCLK), .CE(GRD), .CLR(CLRRDREGS), .D0(RDC0), .D1(RDC1), .D2(RDC2), .D3(RDC3), .Q0(R2D0), .Q1(R2D1),
    .Q2(R2D2), .Q3(R2D3));
  cd4ce U119 (.C(RDCLK), .CE(1'b1), .CLR(1'b0), .Q0(RDC0), .Q1(RDC1), .Q2(RDC2), .Q3(RDC3));  // open: CEO, TC
  fd8ce U117 (.C(SYSCLK), .CE(STP1PT), .CLR(CLEAR), .D(NPT), .Q(P1PT));
  fd8ce U118 (.C(SYSCLK), .CE(STP2PT), .CLR(CLEAR), .D(NPT), .Q(P2PT));
  m4_1e U155 (.D0(PD0PRD), .D1(PD1PRD), .D2(PD2PRD), .D3(PD3PRD), .E(1'b1), .S0(ENCPSEL0), .S1(ENCPSEL1), .O(PDPRD));
  or U153 (ENCPSEL0, PSEL3, PSEL1);
  or U154 (ENCPSEL1, PSEL2, PSEL3);
  X74_153 U157 (
    .I1C0(NPDISP0), .I1C1(NPDISP4), .I1C2(NPDISP8), .I1C3(NPDISP12), .G1(1'b0), .I2C0(NPDISP1),
    .I2C1(NPDISP5), .I2C2(NPDISP9), .I2C3(NPDISP13), .G2(1'b0), .A(ENCPSEL0), .B(ENCPSEL1), .Y1(NPSELDISP0),
    .Y2(NPSELDISP1));
  X74_153 U156 (
    .I1C0(NPDISP2), .I1C1(NPDISP6), .I1C2(NPDISP10), .I1C3(NPDISP14), .G1(1'b0), .I2C0(NPDISP3),
    .I2C1(NPDISP7), .I2C2(NPDISP11), .I2C3(NPDISP15), .G2(1'b0), .A(ENCPSEL0), .B(ENCPSEL1), .Y1(NPSELDISP2),
    .Y2(NPSELDISP3));
  fd4ce U113 (
    .C(SYSCLK), .CE(STDISP3), .CLR(CLEAR), .D0(BRWD0), .D1(BRWD1), .D2(BRWD2), .D3(BRWD3), .Q0(DISP12),
    .Q1(DISP13), .Q2(DISP14), .Q3(DISP15));
  fd4ce U114 (
    .C(SYSCLK), .CE(STDISP2), .CLR(CLEAR), .D0(BRWD0), .D1(BRWD1), .D2(BRWD2), .D3(BRWD3), .Q0(DISP8),
    .Q1(DISP9), .Q2(DISP10), .Q3(DISP11));
  fd4ce U115 (
    .C(SYSCLK), .CE(STDISP1), .CLR(CLEAR), .D0(BRWD0), .D1(BRWD1), .D2(BRWD2), .D3(BRWD3), .Q0(DISP4),
    .Q1(DISP5), .Q2(DISP6), .Q3(DISP7));
  fd4ce U116 (
    .C(SYSCLK), .CE(STDISP0), .CLR(CLEAR), .D0(BRWD0), .D1(BRWD1), .D2(BRWD2), .D3(BRWD3), .Q0(DISP0),
    .Q1(DISP1), .Q2(DISP2), .Q3(DISP3));
  fdc U72 (.C(RDCLK), .CLR(1'b0), .D(P2PLAY), .Q(XLXN_10484));
  fdc U74 (.C(SYSCLK), .CLR(1'b0), .D(XLXN_10482), .Q(XLXN_10495));
  fdc U73 (.C(P2CLK), .CLR(1'b0), .D(XLXN_10484), .Q(XLXN_10482));
  and U75 (P2PLAYSYNCH, ~XLXN_10495, XLXN_10482, XLXN_10484);  // and3b1
  cb16ce U66 (.C(CLOCK), .CE(1'b1), .CLR(1'b0), .Q(QA));  // open: CEO, TC
  cb16ce U67 (.C(QA[15]), .CE(1'b1), .CLR(1'b0), .Q(Q));  // open: CEO, TC
  bufg RDCLK_BUFG (.I(Q[2]), .O(RDCLK));
  bufg SYSCLK_BUFG (.I(Q[7]), .O(SYSCLK));
  bufg P2CLK_BUFG (.I(Q[4]), .O(P2CLK));
  fdc U76 (.C(RDCLK), .CLR(1'b0), .D(P1PLAY), .Q(XLXN_10962));
  fdc U77 (.C(P2CLK), .CLR(1'b0), .D(XLXN_10962), .Q(XLXN_10958));
  fdc U78 (.C(SYSCLK), .CLR(1'b0), .D(XLXN_10958), .Q(XLXN_10960));
  and U79 (P1PLAYSYNCH, ~XLXN_10960, XLXN_10958, XLXN_10962);  // and3b1
  fdce U71 (.C(SYSCLK), .CE(XLXN_74), .CLR(CLEAR), .D(PTOVF), .Q(LPTOVF));
  fd4ce U69 (
    .C(SYSCLK), .CE(CALCPTS), .CLR(CLFF), .D0(PSEL0), .D1(PSEL1), .D2(PSEL2), .D3(PSEL3), .Q0(LPSEL0),
    .Q1(LPSEL1), .Q2(LPSEL2), .Q3(LPSEL3));
  fdce U68 (.C(SYSCLK), .CE(CALCPTS), .CLR(CLFF), .D(PDPRD), .Q(LPDPRD));
  or U70 (XLXN_74, STP2PT, STP1PT);
  add4 U150 (
    .A0(RD0), .A1(RD1), .A2(RD2), .A3(RD3), .B0(DISP12), .B1(DISP13), .B2(DISP14), .B3(DISP15), .CI(1'b0),
    .CO(PD3PRD), .S0(NPDISP12), .S1(NPDISP13), .S2(NPDISP14), .S3(NPDISP15));  // open: OFL
  add4 U151 (
    .A0(RD0), .A1(RD1), .A2(RD2), .A3(RD3), .B0(DISP8), .B1(DISP9), .B2(DISP10), .B3(DISP11), .CI(1'b0),
    .CO(PD2PRD), .S0(NPDISP8), .S1(NPDISP9), .S2(NPDISP10), .S3(NPDISP11));  // open: OFL
  add4 U149 (
    .A0(RD0), .A1(RD1), .A2(RD2), .A3(RD3), .B0(DISP0), .B1(DISP1), .B2(DISP2), .B3(DISP3), .CI(1'b0),
    .CO(PD0PRD), .S0(NPDISP0), .S1(NPDISP1), .S2(NPDISP2), .S3(NPDISP3));  // open: OFL
  add4 U148 (
    .A0(RD0), .A1(RD1), .A2(RD2), .A3(RD3), .B0(DISP4), .B1(DISP5), .B2(DISP6), .B3(DISP7), .CI(1'b0),
    .CO(PD1PRD), .S0(NPDISP4), .S1(NPDISP5), .S2(NPDISP6), .S3(NPDISP7));  // open: OFL
  or U180 (PTOVF, RWDCOT, XLXN_1802);
  comp4 U162 (
    .A0(BRWD0), .A1(BRWD1), .A2(BRWD2), .A3(BRWD3), .B0(DISP8), .B1(DISP9), .B2(DISP10), .B3(DISP11), .EQ(EQ2));
  comp4 U161 (
    .A0(BRWD0), .A1(BRWD1), .A2(BRWD2), .A3(BRWD3), .B0(DISP12), .B1(DISP13), .B2(DISP14), .B3(DISP15),
    .EQ(EQ3));
  comp4 U159 (.A0(BRWD0), .A1(BRWD1), .A2(BRWD2), .A3(BRWD3), .B0(DISP4), .B1(DISP5), .B2(DISP6), .B3(DISP7), .EQ(EQ1));
  comp4 U160 (.A0(BRWD0), .A1(BRWD1), .A2(BRWD2), .A3(BRWD3), .B0(DISP0), .B1(DISP1), .B2(DISP2), .B3(DISP3), .EQ(EQ0));
  not U175 (XLXN_1764, NSD1);
  and U177 (RWD[0], ~NSD1, ~NSD0, BRWD0);  // and3b2
  m2_1e U176 (.D0(BRWD1), .D1(BRWD0), .E(XLXN_1764), .S0(NSD0), .O(RWD[1]));
  X74_153 U174 (
    .I1C0(BRWD2), .I1C1(BRWD1), .I1C2(BRWD0), .I1C3(1'b0), .G1(1'b0), .I2C0(BRWD3), .I2C1(BRWD2),
    .I2C2(BRWD1), .I2C3(BRWD0), .G2(1'b0), .A(NSD0), .B(NSD1), .Y1(RWD[2]), .Y2(RWD[3]));
  and U172 (RWD[6], NSD1, NSD0, BRWD3);
  X74_153 U173 (
    .I1C0(1'b0), .I1C1(BRWD3), .I1C2(BRWD2), .I1C3(BRWD1), .G1(1'b0), .I2C0(1'b0), .I2C1(1'b0), .I2C2(BRWD3),
    .I2C3(BRWD2), .G2(1'b0), .A(NSD0), .B(NSD1), .Y1(RWD[4]), .Y2(RWD[5]));
  X74_153 U170 (
    .I1C0(RDP0EQ0), .I1C1(RDP1EQ0), .I1C2(RDP2EQ0), .I1C3(RDP3EQ0), .G1(1'b0), .I2C0(RDP0EQ1),
    .I2C1(RDP1EQ1), .I2C2(RDP2EQ1), .I2C3(RDP3EQ1), .G2(1'b0), .A(ENCPSEL0), .B(ENCPSEL1), .Y1(UNENCNSD0),
    .Y2(UNENCNSD1));
  m4_1e U169 (
    .D0(RDP0EQ2), .D1(RDP1EQ2), .D2(RDP2EQ2), .D3(RDP3EQ2), .E(1'b1), .S0(ENCPSEL0), .S1(ENCPSEL1),
    .O(UNENCNSD2));
  add4 U171 (
    .A0(UNENCNSD1), .A1(1'b0), .A2(1'b0), .A3(1'b0), .B0(UNENCNSD2), .B1(1'b0), .B2(1'b0), .B3(1'b0),
    .CI(UNENCNSD0), .S0(NSD0), .S1(NSD1));  // open: CO, OFL, S2, S3
  and U168 (RDP0EQ0, RDP0EQ1, EQ3);
  buf RDP0EQ2_BUF (RDP0EQ2, EQ1);
  and U167 (RDP0EQ1, RDP0EQ2, EQ2);
  buf RDP1EQ2_B (RDP1EQ2, EQ0);
  and U166 (RDP1EQ0, RDP1EQ1, EQ3);
  buf RDP1EQ1_BUF (RDP1EQ1, EQ2);
  buf RDP2EQ1_B (RDP2EQ1, EQ1);
  and U165 (RDP2EQ0, RDP2EQ1, EQ0);
  buf RDP2EQ2_BUF (RDP2EQ2, EQ3);
  and U164 (RDP3EQ0, RDP3EQ1, EQ0);
  buf RDP3EQ2_BUF (RDP3EQ2, EQ2);
  and U163 (RDP3EQ1, RDP3EQ2, EQ1);
  add8 U182 (.A({1'b0, RWD}), .B(CODERWD), .CI(1'b0), .CO(RWDCOT), .S(TOTRWD));  // open: OFL
  add8 U181 (.A(PT), .B(TOTRWD), .CI(1'b0), .CO(XLXN_1802), .S(NPT));  // open: OFL
  CODEGEN M1 (
    .PSEL0(PSEL0), .PSEL1(PSEL1), .CALCPTS(CALCPTS), .CLRRDREGS(CLRRDREGS), .GETCODE(GETCODE),
    .SYSCLK(SYSCLK),
    .CODERWD({CODERWD[0], CODERWD[1], CODERWD[2], CODERWD[3], CODERWD[4], CODERWD[5], CODERWD[6], CODERWD[7]}),
    .R2D1(R2D1), .R2D2(R2D2), .R1D1(R1D1), .R1D0(R1D0), .RDC1(RDC1), .R1D3(R1D3), .R2D0(R2D0), .RDC3(RDC3),
    .DISP0(DISP0), .DISP1(DISP1), .DISP2(DISP2), .DISP3(DISP3), .DISP4(DISP4), .DISP5(DISP5), .DISP6(DISP6),
    .DISP7(DISP7), .BRWD0(BRWD0), .BRWD1(BRWD1), .BRWD2(BRWD2), .BRWD3(BRWD3));
  and U5 (CLRSHFTREG, ~INITIALSHIFT, P1PLAYSYNCH, S0);  // and3b1
  and U29 (XLXN_12237, S1P1PLAYED, P1ADD);
  and U30 (XLXN_12236, S4P2PLAYED, P2ADD);
  and U48 (S3P1PLAYSYNCHADJ, LP1NSD, P1PLAYSYNCH, S3);
  and U47 (S3P2PLAYSYNCH, ~LP1NSD, P2PLAYSYNCH, S3);  // and3b1
  and U46 (S1P1SKIP, 1'b0, S1);
  and U45 (S1P1PLAYED, P1PLAYED, S1);
  and U44 (S0P1PLAYSYNCH, INITIALSHIFT, P1PLAYSYNCH, S0);
  nor U42 (INT_NET11, LP2NSD, LP1NSD);
  fdc U43 (.C(SYSCLK), .CLR(INT_NET11), .D(CLRTOPLAY), .Q(CLPXNSDFF));
  cb4cle U64 (
    .C(SYSCLK), .CE(CLKEN), .CLR(RESET), .D0(S3S6COND), .D1(S4P2SKIP), .D2(S1S4S6COND), .D3(1'b0),
    .L(XLXN_12173), .Q0(STR0), .Q1(STR1), .Q2(STR2));  // open: CEO, Q3, TC
  d3_8e U65 (
    .A0(STR0), .A1(STR1), .A2(STR2), .E(1'b1), .D0(S0), .D1(S1), .D2(S2), .D3(S3), .D4(S4), .D5(S5), .D6(S6));  // open: D7
  or U40 (NEXTPLAY, S3S6COND, S1P1SKIP, S6P2PLAYSYNCHADJ, S3P2PLAYSYNCH);
  buf P2STURN_BUF (P2STURN, S4);
  or U1 (CLEARP2FFS, S1, S6P2PLAYSYNCHADJ);
  and U2 (CLFF, ~LPTOVF, XLXN_12199);  // and2b1
  or U3 (XLXN_12199, S0, NEXTPLAY);
  or U7 (DISPSEL1, XLXN_12205, SHNXRDS);
  or U8 (DISPSEL0, SHPTS, XLXN_12205);
  and U9 (XLXN_12205, SHPTS, P1PLAY);
  or U10 (SHNXRDS, XLXN_12213, XLXN_12212);
  and U11 (XLXN_12212, S1, P1PLAY);
  and U12 (XLXN_12213, ~LP1NSD, P1PLAY, S3);  // and3b1
  buf CALCPTS_BUF (CALCPTS, S2ORS5);
  and U13 (STDISP3, PSEL3, CALCPTS);
  and U14 (STDISP2, PSEL2, CALCPTS);
  and U36 (BPDF, INT_NET1, INT_NET2);
  and U38 (INT_NET1, ~LPTOVF, ~SHPTS, XLXN_12257);  // and3b2
  and U37 (INT_NET2, ADD, LPDPRD);
  and U35 (BPDS, ~INT_NET2, INT_NET1);  // and2b1
  or U31 (INT_NET10, XLXN_12236, XLXN_12237);
  or U33 (INT_NET6, CLRSHFTREG, INT_NET8);
  and U34 (INT_NET8, ~S0, NEXTPLAY);  // and2b1
  and U32 (GRD, ~LPTOVF, INT_NET6);  // and2b1
  and U27 (XLXN_12247, ~S4, ~S1, XLXN_12248);  // and3b2
  and U15 (STDISP1, PSEL1, CALCPTS);
  and U25 (XLXN_12324, P1ADD, S1);
  fdce U28 (.C(SYSCLK), .CE(INT_NET10), .CLR(CLRTOPLAY), .D(1'b1), .Q(XLXN_12248));
  and U26 (XLXN_12325, P2ADD, S4);
  or U39 (XLXN_12257, S3, S6);
  or U41 (CLRTOPLAY, NEXTPLAY, S0, S4P2SKIP);
  or U60 (S3S6COND, S3P1PLAYSYNCHADJ, S6P1PLAYSYNCH);
  and U63 (XLXN_12173, ~LPTOVF, CENLD);  // and2b1
  or U62 (CENLD, S1S4S6COND, S3S6COND);
  fdce U50 (.C(SYSCLK), .CE(S2), .CLR(CLPXNSDFF), .D(CRNTADJ), .Q(LP1NSD));
  or U49 (CRNTADJ, NSD1, NSD0);
  fdce U55 (.C(SYSCLK), .CE(S5), .CLR(CLPXNSDFF), .D(CRNTADJ), .Q(LP2NSD));
  and U54 (S6P2PLAYSYNCHADJ, LP2NSD, P2PLAYSYNCH, S6);
  and U53 (S6P1PLAYSYNCH, ~LP2NSD, P1PLAYSYNCH, S6);  // and3b1
  and U52 (S4P2SKIP, P2SKIP, S4);
  and U51 (S4P2PLAYED, P2PLAYED, S4);
  or U56 (XLXN_12299, S4P2PLAYED, S3P2PLAYSYNCH, S1P1PLAYED, S0P1PLAYSYNCH);
  and U59 (CLKEN, ~LPTOVF, XLXN_12297);  // and2b1
  or U57 (S2ORS5, S5, S2);
  or U58 (XLXN_12297, CENLD, S2ORS5, XLXN_12299);
  or U61 (S1S4S6COND, S6P2PLAYSYNCHADJ, S4P2SKIP, S1P1SKIP);
  buf SELPLYR_BUF (SELPLYR, STR2);
  and U18 (STP2PT, ~LPTOVF, S5);  // and2b1
  and U17 (STP1PT, ~LPTOVF, S2);  // and2b1
  and U16 (STDISP0, PSEL0, CALCPTS);
  and U4 (GETCODE, INITIALSHIFT, S0);
  cb2ce U6 (.C(SYSCLK), .CE(CLRSHFTREG), .CLR(CLRRDREGS), .TC(INITIALSHIFT));  // open: CEO, Q0, Q1
  buf CLEAR_BUF (CLEAR, RESET);
  or U24 (XLXN_12343, XLXN_12247, XLXN_12325, XLXN_12324);
  fdc U19 (.C(P2CLK), .CLR(S1), .D(CLEAR), .Q(XLXN_12333));
  fdc U21 (.C(P2CLK), .CLR(S1), .D(XLXN_12334), .Q(XLXN_12335));
  fdc U20 (.C(P2CLK), .CLR(S1), .D(XLXN_12333), .Q(XLXN_12334));
  buf P1STURN_BUF (P1STURN, S1);
  and U22 (CLRRDREGS, ~XLXN_12335, XLXN_12334, XLXN_12333);  // and3b1
  or U293 (CLEARP1FFS, S4, S3P1PLAYSYNCHADJ);
  and U23 (ADD, ~LPTOVF, XLXN_12343);  // and2b1
  X74_157 U80 (
    .A0(DISP12), .A1(DISP13), .A2(DISP14), .A3(DISP15), .B0(P2PT[4]), .B1(P2PT[5]), .B2(P2PT[6]),
    .B3(P2PT[7]), .G(1'b0), .S(DISPSEL0), .Y0(DDISP12), .Y3(DDISP15), .Y1(DDISP13), .Y2(DDISP14));
  X74_157 U81 (
    .A0(DISP8), .A1(DISP9), .A2(DISP10), .A3(DISP11), .B0(P2PT[0]), .B1(P2PT[1]), .B2(P2PT[2]), .B3(P2PT[3]),
    .G(1'b0), .S(DISPSEL0), .Y0(DDISP8), .Y3(DDISP11), .Y1(DDISP9), .Y2(DDISP10));
  X74_157 U152 (
    .A0(P1SEL0), .A1(P1SEL1), .A2(P1SEL2), .A3(P1SEL3), .B0(P2SEL0), .B1(P2SEL1), .B2(P2SEL2), .B3(P2SEL3),
    .G(1'b0), .S(SELPLYR), .Y0(PSEL0), .Y3(PSEL3), .Y1(PSEL1), .Y2(PSEL2));
  X74_157 U158 (
    .A0(RD0), .A1(RD1), .A2(RD2), .A3(RD3), .B0(NPSELDISP0), .B1(NPSELDISP1), .B2(NPSELDISP2),
    .B3(NPSELDISP3), .G(1'b0), .S(ADD), .Y0(BRWD0), .Y3(BRWD3), .Y1(BRWD1), .Y2(BRWD2));
  X74_157 U179 (
    .A0(P1PT[0]), .A1(P1PT[1]), .A2(P1PT[2]), .A3(P1PT[3]), .B0(P2PT[0]), .B1(P2PT[1]), .B2(P2PT[2]),
    .B3(P2PT[3]), .G(1'b0), .S(SELPLYR), .Y0(PT[0]), .Y3(PT[3]), .Y1(PT[1]), .Y2(PT[2]));
  X74_157 U178 (
    .A0(P1PT[4]), .A1(P1PT[5]), .A2(P1PT[6]), .A3(P1PT[7]), .B0(P2PT[4]), .B1(P2PT[5]), .B2(P2PT[6]),
    .B3(P2PT[7]), .G(1'b0), .S(SELPLYR), .Y0(PT[4]), .Y3(PT[7]), .Y1(PT[5]), .Y2(PT[6]));
  title #(.NameFieldText("Zach Gonzalez-Ruskiewicz, Israel Milgrom, Mehmed Mladenov, Danny Janani"), .TitleFieldText("Ppm Control Unit  -  CS 2204 - Section A - Fall 2017")) XLXI_1261 ();
  title #(.TitleFieldText("Ppm Input/output Block  -  CS 2204 - Section A - Fall 2017"), .NameFieldText("Zach Gonzalez-Ruskiewicz, Israel Milgrom, Mehmed Mladenov, Danny Janani")) XLXI_1272 ();
  title #(.TitleFieldText("Ppm First Machine Play Block  -  CS 2204 - Section A - Fall 2017"), .NameFieldText("Zach Gonzalez-Ruskiewicz, Israel Milgrom, Mehmed Mladenov, Danny Janani")) XLXI_1286 ();
  title #(.TitleFieldText("Ppm Play Check Block  -  CS 2204 - Section A - Fall 2017"), .NameFieldText("Zach Gonzalez-Ruskiewicz, Israel Milgrom, Mehmed Mladenov, Danny Janani")) XLXI_1264 ();
  title #(.TitleFieldText("Ppm Points Calculation Block  -  CS 2204 - Section A - Fall 2017"), .NameFieldText("Zach Gonzalez-Ruskiewicz, Israel Milgrom, Mehmed Mladenov, Danny Janani")) XLXI_1265 ();
  ibuf RESET_BUF (.I(RESET_NP2B), .O(RESET));
  ibuf SHPTS_BUF (.I(SHPTS_NP2B), .O(SHPTS));
  ibuf CLOCK_BUF (.I(CLOCK_NP2B), .O(XLXN_2370));
  bufg CLOCK_BUFG (.I(XLXN_2370), .O(CLOCK));
  obuf RD3_BUF (.I(RD3), .O(RD3_NB2P));
  obuf RD2_BUF (.I(RD2), .O(RD2_NB2P));
  obuf RD1_BUF (.I(RD1), .O(RD1_NB2P));
  obuf RD0_BUF (.I(RD0), .O(RD0_NB2P));
  obuf ADD_BUF (.I(ADD), .O(ADD_NB2P));
  obuf STR2_BUF (.I(STR2), .O(STR2_NB2P));
  obuf STR1_BUF (.I(STR1), .O(STR1_NB2P));
  obuf STR0_BUF (.I(STR0), .O(STR0_NB2P));
  obuf DISPEN0_BUF (.I(DISPEN[0]), .O(A0_NB2P));
  obuf DISPEN1_BUF (.I(DISPEN[1]), .O(A1_NB2P));
  obuf DISPEN2_BUF (.I(DISPEN[2]), .O(A2_NB2P));
  obuf DISPEN3_BUF (.I(DISPEN[3]), .O(A3_NB2P));
  obuf CG_BUF (.I(SBUS[0]), .O(CG_NB2P));
  obuf CF_BUF (.I(SBUS[1]), .O(CF_NB2P));
  obuf CE_BUF (.I(SBUS[2]), .O(CE_NB2P));
  obuf CD_BUF (.I(SBUS[3]), .O(CD_NB2P));
  obuf CC_BUF (.I(SBUS[4]), .O(CC_NB2P));
  obuf CB_BUF (.I(SBUS[5]), .O(CB_NB2P));
  obuf CA_BUF (.I(SBUS[6]), .O(CA_NB2P));
  ibuf P2PLAY_BUF (.I(P2PLAY_NP2B), .O(P2PLAY));
  ibuf P1PLAY_BUF (.I(P1PLAY_NP2B), .O(P1PLAY));
  cb4ce U86 (.C(Q[0]), .CE(1'b1), .CLR(1'b0), .Q0(MC0), .Q1(MC1), .Q2(MC2));  // open: CEO, Q3, TC
  d3_8e U295 (
    .A0(MC0), .A1(MC1), .A2(MC2), .E(XLXN_210), .D0(DCDEN0), .D1(DCDEN1), .D2(DCDEN2), .D3(DCDEN3),
    .D4(DCDEN4), .D5(DCDEN5), .D6(DCDEN6), .D7(DCDEN7));
  or U294 (XLXN_210, ~LPTOVF, Q[8]);  // or2b1
  or U88 (XLXN_203, ~BPDS, Q[8]);  // or2b1
  and U89 (INT_NET0, XLXN_203, XLXN_202);
  or U92 (XLXN_181, ~LPSEL0, INT_NET0);  // or2b1
  or U94 (XLXN_195, ~LPSEL1, INT_NET0);  // or2b1
  or U96 (XLXN_194, ~LPSEL2, INT_NET0);  // or2b1
  or U98 (XLXN_193, ~LPSEL3, INT_NET0);  // or2b1
  nand U95 (DISPEN[1], DCDEN1, XLXN_195);
  nand U97 (DISPEN[2], DCDEN2, XLXN_194);
  nand U99 (DISPEN[3], DCDEN3, XLXN_193);
  nand U93 (DISPEN[0], DCDEN0, XLXN_181);
  or U87 (XLXN_202, ~BPDF, Q[6]);  // or2b1
  title #(.TitleFieldText("Workspace Block  -  CS 2204 - Section A - Fall 2017"), .NameFieldText("Zach Gonzalez-Ruskiewicz, Israel Milgrom, Mehmed Mladenov, Danny Janani")) XLXI_2042 ();
  obuf XLXI_1814 (.I(XLXN_16496), .O(LED15));
  not XLXI_1566 (XLXN_12049, DCDEN4);
  not XLXI_1575 (XLXN_12041, DCDEN5);
  not XLXI_1576 (XLXN_12042, DCDEN6);
  obuf XLXI_1511 (.I(XLXN_12042), .O(A6_NB2P));
  obuf XLXI_1510 (.I(XLXN_12041), .O(A5_NB2P));
  obuf XLXI_1509 (.I(XLXN_12049), .O(A4_NB2P));
  title #(.TitleFieldText("Second I/O Block  -  CS 2204 - Section A - Fall 2017"), .NameFieldText("Zach Gonzalez-Ruskiewicz, Israel Milgrom, Mehmed Mladenov, Danny Janani")) XLXI_2078 ();
  not XLXI_1577 (XLXN_12043, DCDEN7);
  obuf XLXI_1512 (.I(XLXN_12043), .O(A7_NB2P));
  m8_1e U296 (
    .D0(DDISP1), .D1(DDISP5), .D2(DDISP9), .D3(DDISP13), .D4(DISP4INP1), .D5(DISP5INP1), .D6(DISP6INP1),
    .D7(DISP7INP1), .E(1'b1), .S0(MC0), .S1(MC1), .S2(MC2), .O(KSBUS[1]));
  m8_1e U298 (
    .D0(DDISP3), .D1(DDISP7), .D2(DDISP11), .D3(DDISP15), .D4(DISP4INP3), .D5(DISP5INP3), .D6(DISP6INP3),
    .D7(DISP7INP3), .E(1'b1), .S0(MC0), .S1(MC1), .S2(MC2), .O(KSBUS[3]));
  m8_1e U297 (
    .D0(DDISP0), .D1(DDISP4), .D2(DDISP8), .D3(DDISP12), .D4(DISP4INP0), .D5(DISP5INP0), .D6(DISP6INP0),
    .D7(DISP7INP0), .E(1'b1), .S0(MC0), .S1(MC1), .S2(MC2), .O(KSBUS[0]));
  m8_1e U299 (
    .D0(DDISP2), .D1(DDISP6), .D2(DDISP10), .D3(DDISP14), .D4(DISP4INP2), .D5(DISP5INP2), .D6(DISP6INP2),
    .D7(DISP7INP2), .E(1'b1), .S0(MC0), .S1(MC1), .S2(MC2), .O(KSBUS[2]));
  X74_157 U315 (
    .A0(R0D0), .A1(R0D1), .A2(R0D2), .A3(R0D3), .B0(KEYPAD[0]), .B1(KEYPAD[1]), .B2(KEYPAD[2]),
    .B3(KEYPAD[3]), .G(1'b0), .S(Testrd), .Y0(RD0), .Y3(RD3), .Y1(RD1), .Y2(RD2));
  m8_1e U184 (
    .D0(P1SEL0), .D1(XLXN_11863), .D2(XLXN_11863), .D3(1'b0), .D4(XLXN_11863), .D5(1'b0), .D6(1'b0),
    .D7(1'b0), .E(1'b1), .S0(P1SEL1), .S1(P1SEL2), .S2(P1SEL3), .O(P2PLAYED));
  not U183 (XLXN_11863, P1SEL0);
  buf P2SEL3_BUF (P2SEL3, P1SEL3);
  buf P2SKIP_BUF (P2SKIP, P1PLAYSYNCH);
  buf P2ADD_BUF (P2ADD, P1ADD);
  buf P2SEL2_BUF (P2SEL2, P1SEL2);
  buf P2SEL1_BUF (P2SEL1, P1SEL1);
  buf P2SEL0_BUF (P2SEL0, P1SEL0);
  buf XLXI_2139 (DISP7INP3, P2PT[7]);
  buf XLXI_2140 (DISP7INP2, P2PT[6]);
  buf XLXI_2141 (DISP7INP1, P2PT[5]);
  buf XLXI_2142 (DISP7INP0, P2PT[4]);
  buf XLXI_2120 (DISP6INP3, P2PT[3]);
  buf XLXI_2119 (DISP6INP2, P2PT[2]);
  buf XLXI_2118 (DISP6INP1, P2PT[1]);
  buf XLXI_2117 (DISP6INP0, P2PT[0]);
  buf XLXI_2094 (DISP5INP3, P1PT[7]);
  buf XLXI_2095 (DISP5INP2, P1PT[6]);
  buf XLXI_2096 (DISP5INP1, P1PT[5]);
  buf XLXI_2097 (DISP5INP0, P1PT[4]);
  buf XLXI_2080 (DISP4INP3, P1PT[3]);
  buf XLXI_2081 (DISP4INP2, P1PT[2]);
  buf XLXI_2083 (DISP4INP0, P1PT[0]);
  buf XLXI_2082 (DISP4INP1, P1PT[1]);
  obuf XLXI_2297 (.I(CODEDIG0FOUND), .O(led16_g));
  obuf XLXI_2299 (.I(CODEDIG1FOUND), .O(led17_g));
  not XLXI_2302 (led16_r, CODEDIG0FOUND);
  not XLXI_2304 (led17_r, CODEDIG1FOUND);
  PmodKEYPAD M6 (.JA(KEYPADINPOUT), .Keypadout(KEYPAD), .Clk(CLOCK));
  SEVENSEGMENTDECODER M5 (
    .ANUM0(PMODDISP0), .BNUM0(PMODDISP4), .ANUM1(PMODDISP1), .BNUM1(PMODDISP5), .ANUM2(PMODDISP2),
    .BNUM2(PMODDISP6), .BNUM3(PMODDISP7), .ANUM3(PMODDISP3), .CLKINP(Q[0]), .AC(AC), .AE(AE), .AF(AF),
    .AG(AG), .AA(AA), .AB(AB), .AD(AD), .DIGSEL(DIGSEL));
  X74_157 XLXI_2220 (
    .A0(KEYPAD[0]), .A1(KEYPAD[1]), .A2(KEYPAD[2]), .A3(KEYPAD[3]), .B0(CODEDIG0), .B1(CODEDIG1),
    .B2(CODEDIG2), .B3(CODEDIG3), .G(1'b0), .S(CodeOrKeypad), .Y0(PMODDISP4), .Y3(PMODDISP7), .Y1(PMODDISP5),
    .Y2(PMODDISP6));
  X74_157 XLXI_2224 (
    .A0(R2D0), .A1(R2D1), .A2(R2D2), .A3(R2D3), .B0(CODEDIG4), .B1(CODEDIG5), .B2(CODEDIG6), .B3(CODEDIG7),
    .G(1'b0), .S(CodeOrKeypad), .Y0(PMODDISP0), .Y3(PMODDISP3), .Y1(PMODDISP1), .Y2(PMODDISP2));
  cb4ce XLXI_2526 (
    .C(P2CLK), .CE(XLXN_12058), .CLR(CLEARP1FFS), .Q0(XLXN_14083), .Q1(XLXN_14084), .Q2(XLXN_14085),
    .Q3(TESTING));  // open: CEO, TC
  d3_8e XLXI_2528 (
    .A0(XLXN_14083), .A1(XLXN_14084), .A2(XLXN_14085), .E(PLAYING), .D0(P1ST0), .D1(P1ST1), .D2(P1ST2),
    .D3(P1ST3), .D4(P1ST4), .D5(P1ST5), .D6(P1ST6), .D7(P1ST7));
  and U272 (XLXN_12058, ~P1PLAYED, P1STURN);  // and2b1
  not XLXI_2533 (PLAYING, TESTING);
  and XLXI_2534 (XLXN_14166, ~ACTCODE, P2CODEPOSS);  // and2b1
  and XLXI_2535 (XLXN_14167, ~ACTCODE, ~ACTP2CODE, ADJPOSS);  // and3b2
  and XLXI_2537 (XLXN_14168, ~ACTTEST, ~ACTP2CODE, ~ACTADJ, TESTPOSS);  // and4b3
  or XLXI_2538 (STORE, XLXN_14168, XLXN_14167, XLXN_14166, CODEPOSS);
  nor XLXI_2541 (ACTDEFAULT, ACTTEST, ACTADJ, ACTP2CODE, ACTCODE);
  fd4ce XLXI_2539 (
    .C(P2CLK), .CE(STORE), .CLR(CLEARP1FFS), .D0(CODEPOSS), .D1(P2CODEPOSS), .D2(ADJPOSS), .D3(TESTPOSS),
    .Q0(ACTCODE), .Q1(ACTP2CODE), .Q2(ACTADJ), .Q3(ACTTEST));
  fd4ce XLXI_2544 (
    .CE(STORE), .CLR(CLEARP1FFS), .D0(P1SEL0), .D1(P1SEL1), .D2(P1SEL2), .D3(P1SEL3), .Q0(P1ACTPOSPLAY0),
    .Q1(P1ACTPOSPLAY1), .Q2(P1ACTPOSPLAY2), .Q3(P1ACTPOSPLAY3));  // open: C
  fdce XLXI_2545 (.C(P2CLK), .CE(STORE), .CLR(CLEARP1FFS), .D(P1ADD), .Q(P1ACTADD));
  add4 XLXI_2216 (
    .A0(R1D0), .A1(R1D1), .A2(R1D2), .A3(R1D3), .B0(DISP4), .B1(DISP5), .B2(DISP6), .B3(DISP7), .CI(1'b0),
    .S0(XLXN_12854), .S1(XLXN_12855), .S2(XLXN_12856), .S3(XLXN_12857));  // open: CO, OFL
  comp4 XLXI_2215 (
    .A0(CODEDIG4), .A1(CODEDIG5), .A2(CODEDIG6), .A3(CODEDIG7), .B0(XLXN_12854), .B1(XLXN_12855),
    .B2(XLXN_12856), .B3(XLXN_12857), .EQ(P2CANPLAYCODEWADDDISP1));
  or XLXI_2744 (DISP0STORIN[0], DISP0STOROUT[0], DISP0DEC0);
  or XLXI_2745 (DISP0STORIN[1], DISP0STOROUT[1], DISP0DEC1);
  or XLXI_2746 (DISP0STORIN[2], DISP0STOROUT[2], DISP0DEC2);
  or XLXI_2747 (DISP0STORIN[3], DISP0STOROUT[3], DISP0DEC3);
  or XLXI_2760 (DISP0STORIN[4], DISP0STOROUT[4], DISP0DEC4);
  or XLXI_2761 (DISP0STORIN[5], DISP0STOROUT[5], DISP0DEC5);
  or XLXI_2762 (DISP0STORIN[6], DISP0STOROUT[6], DISP0DEC6);
  or XLXI_2763 (DISP0STORIN[7], DISP0STOROUT[7], DISP0DEC7);
  or XLXI_2768 (DISP0STORIN[8], DISP0STOROUT[8], DISP0DEC8);
  or XLXI_2769 (DISP0STORIN[9], DISP0STOROUT[9], DISP0DEC9);
  or XLXI_2770 (DISP0STORIN[10], DISP0STOROUT[10], DISP0DEC10);
  or XLXI_2771 (DISP0STORIN[11], DISP0STOROUT[11], DISP0DEC11);
  or XLXI_2772 (DISP0STORIN[12], DISP0STOROUT[12], DISP0DEC12);
  or XLXI_2773 (DISP0STORIN[13], DISP0STOROUT[13], DISP0DEC13);
  or XLXI_2774 (DISP0STORIN[14], DISP0STOROUT[14], DISP0DEC14);
  or XLXI_2775 (DISP0STORIN[15], DISP0STOROUT[15], DISP0DEC15);
  or XLXI_2781 (DISP1STORIN[0], DISP1STOROUT[0], DISP1DEC0);
  or XLXI_2782 (DISP1STORIN[1], DISP1STOROUT[1], DISP1DEC1);
  or XLXI_2783 (DISP1STORIN[2], DISP1STOROUT[2], DISP1DEC2);
  or XLXI_2784 (DISP1STORIN[3], DISP1STOROUT[3], DISP1DEC3);
  or XLXI_2785 (DISP1STORIN[4], DISP1STOROUT[4], DISP1DEC4);
  or XLXI_2786 (DISP1STORIN[5], DISP1STOROUT[5], DISP1DEC5);
  or XLXI_2787 (DISP1STORIN[6], DISP1STOROUT[6], DISP1DEC6);
  or XLXI_2788 (DISP1STORIN[7], DISP1STOROUT[7], DISP1DEC7);
  or XLXI_2789 (DISP1STORIN[8], DISP1STOROUT[8], DISP1DEC8);
  or XLXI_2790 (DISP1STORIN[9], DISP1STOROUT[9], DISP1DEC9);
  or XLXI_2791 (DISP1STORIN[10], DISP1STOROUT[10], DISP1DEC10);
  or XLXI_2792 (DISP1STORIN[11], DISP1STOROUT[11], DISP1DEC11);
  or XLXI_2793 (DISP1STORIN[12], DISP1STOROUT[12], DISP1DEC12);
  or XLXI_2794 (DISP1STORIN[13], DISP1STOROUT[13], DISP1DEC13);
  or XLXI_2795 (DISP1STORIN[14], DISP1STOROUT[14], DISP1DEC14);
  or XLXI_2796 (DISP1STORIN[15], DISP1STOROUT[15], DISP1DEC15);
  and XLXI_2238 (XLXN_14960, CODEDIG1FOUND, XLXN_12940);
  or XLXI_2378 (XLXN_12940, P2CANPLAYCODEWADDDISP1, P2CANPLAYCODEDIRECTDISP1);
  and XLXI_2237 (XLXN_14959, CODEDIG0FOUND, XLXN_12935);
  or XLXI_2235 (XLXN_12935, P2CANPLAYCODEWADDDISP0, P2CANPLAYCODEDIRECTDISP0);
  m2_1 XLXI_2726 (.D0(XLXN_14959), .D1(XLXN_14960), .S0(TESTINGPOS1), .O(XLXN_14972));
  and XLXI_2727 (P2CODEPOSS, TESTCD, XLXN_14972);
  comp4 XLXI_2210 (
    .A0(R1D0), .A1(R1D1), .A2(R1D2), .A3(R1D3), .B0(CODEDIG0), .B1(CODEDIG1), .B2(CODEDIG2), .B3(CODEDIG3),
    .EQ(P2CANPLAYCODEDIRECTDISP0));
  comp4 XLXI_2221 (
    .A0(R1D0), .A1(R1D1), .A2(R1D2), .A3(R1D3), .B0(CODEDIG4), .B1(CODEDIG5), .B2(CODEDIG6), .B3(CODEDIG7),
    .EQ(P2CANPLAYCODEDIRECTDISP1));
  comp4 XLXI_2214 (
    .A0(CODEDIG0), .A1(CODEDIG1), .A2(CODEDIG2), .A3(CODEDIG3), .B0(XLXN_12843), .B1(XLXN_12844),
    .B2(XLXN_12845), .B3(XLXN_12846), .EQ(P2CANPLAYCODEWADDDISP0));
  add4 XLXI_2211 (
    .A0(R1D0), .A1(R1D1), .A2(R1D2), .A3(R1D3), .B0(DISP0), .B1(DISP1), .B2(DISP2), .B3(DISP3), .CI(1'b0),
    .S0(XLXN_12843), .S1(XLXN_12844), .S2(XLXN_12845), .S3(XLXN_12846));  // open: CO, OFL
  and XLXI_2883 (POS0P2CPCD4, DISP0STOROUT[4], DECBRWD4);
  and XLXI_2884 (POS0P2CPCD5, DISP0STOROUT[5], DECBRWD5);
  and XLXI_2885 (POS0P2CPCD6, DISP0STOROUT[6], DECBRWD6);
  and XLXI_2886 (POS0P2CPCD7, DISP0STOROUT[7], DECBRWD7);
  and XLXI_2887 (POS0P2CPCD8, DISP0STOROUT[8], DECBRWD8);
  and XLXI_2888 (POS0P2CPCD9, DISP0STOROUT[9], DECBRWD9);
  and XLXI_2889 (POS0P2CPCD10, DISP0STOROUT[10], DECBRWD10);
  and XLXI_2890 (POS0P2CPCD11, DISP0STOROUT[11], DECBRWD11);
  and XLXI_2899 (POS0P2CPCD0, DISP0STOROUT[0], DECBRWD0);
  and XLXI_2900 (POS0P2CPCD1, DISP0STOROUT[1], DECBRWD1);
  and XLXI_2901 (POS0P2CPCD2, DISP0STOROUT[2], DECBRWD2);
  and XLXI_2902 (POS0P2CPCD3, DISP0STOROUT[3], DECBRWD3);
  and XLXI_2891 (POS0P2CPCD12, DISP0STOROUT[12], DECBRWD12);
  and XLXI_2892 (POS0P2CPCD13, DISP0STOROUT[13], DECBRWD13);
  and XLXI_2893 (POS0P2CPCD14, DISP0STOROUT[14], DECBRWD14);
  and XLXI_2894 (POS0P2CPCD15, DISP0STOROUT[15], DECBRWD15);
  fd16ce XLXI_2740 (.C(SYSCLK), .CE(PLAYERPLAYED), .CLR(RESET), .D(DISP0STORIN), .Q(DISP0STOROUT));
  fd16ce XLXI_2743 (.C(SYSCLK), .CE(PLAYERPLAYED), .CLR(RESET), .D(DISP1STORIN), .Q(DISP1STOROUT));
  or XLXI_2824 (PLAYERPLAYED, P2PLAYED, P1PLAYED);
  and XLXI_2922 (POS1P2CPCD15, DISP1STOROUT[15], DECBRWD15);
  and XLXI_2921 (POS1P2CPCD14, DISP1STOROUT[14], DECBRWD14);
  and XLXI_2920 (POS1P2CPCD13, DISP1STOROUT[13], DECBRWD13);
  and XLXI_2919 (POS1P2CPCD12, DISP1STOROUT[12], DECBRWD12);
  and XLXI_2906 (POS1P2CPCD3, DISP1STOROUT[3], DECBRWD3);
  and XLXI_2905 (POS1P2CPCD2, DISP1STOROUT[2], DECBRWD2);
  and XLXI_2904 (POS1P2CPCD1, DISP1STOROUT[1], DECBRWD1);
  and XLXI_2903 (POS1P2CPCD0, DISP1STOROUT[0], DECBRWD0);
  and XLXI_2918 (POS1P2CPCD11, DISP1STOROUT[11], DECBRWD11);
  and XLXI_2917 (POS1P2CPCD10, DISP1STOROUT[10], DECBRWD10);
  and XLXI_2916 (POS1P2CPCD9, DISP1STOROUT[9], DECBRWD9);
  and XLXI_2915 (POS1P2CPCD8, DISP1STOROUT[8], DECBRWD8);
  and XLXI_2914 (POS1P2CPCD7, DISP1STOROUT[7], DECBRWD7);
  and XLXI_2913 (POS1P2CPCD6, DISP1STOROUT[6], DECBRWD6);
  and XLXI_2912 (POS1P2CPCD5, DISP1STOROUT[5], DECBRWD5);
  and XLXI_2911 (POS1P2CPCD4, DISP1STOROUT[4], DECBRWD4);
  X74_157 XLXI_2668 (
    .A0(CODEDIG0), .A1(CODEDIG1), .A2(CODEDIG2), .A3(CODEDIG3), .B0(CODEDIG4), .B1(CODEDIG5), .B2(CODEDIG6),
    .B3(CODEDIG7), .G(TESTCD), .S(TESTINGPOS1), .Y0(XLXN_14728), .Y3(XLXN_14731), .Y1(XLXN_14729),
    .Y2(XLXN_14730));
  or XLXI_2673 (XLXN_14765, P1ST4, P1ST3, P1ST0, P1ST0);
  nor XLXI_2681 (TESTCD, XLXN_14766, XLXN_14765);
  m2_1 XLXI_2682 (.D0(CODEDIG0FOUND), .D1(CODEDIG1FOUND), .S0(TESTINGPOS1), .O(XLXN_14766));
  comp4 XLXI_2632 (
    .A0(BRWD0), .A1(BRWD1), .A2(BRWD2), .A3(BRWD3), .B0(XLXN_14728), .B1(XLXN_14729), .B2(XLXN_14730),
    .B3(XLXN_14731), .EQ(CODEPOSS));
  or XLXI_3119 (TESTINGPOS0, P1ST3, P1ST0);
  or XLXI_3120 (TESTINGPOS1, P1ST4, P1ST1);
  d4_16e XLXI_2336 (
    .A0(DISP4), .A1(DISP5), .A2(DISP6), .A3(DISP7), .E(1'b1), .D0(DISP1DEC0), .D1(DISP1DEC1),
    .D10(DISP1DEC10), .D11(DISP1DEC11), .D12(DISP1DEC12), .D13(DISP1DEC13), .D14(DISP1DEC14),
    .D15(DISP1DEC15), .D2(DISP1DEC2), .D3(DISP1DEC3), .D4(DISP1DEC4), .D5(DISP1DEC5), .D6(DISP1DEC6),
    .D7(DISP1DEC7), .D8(DISP1DEC8), .D9(DISP1DEC9));
  d4_16e XLXI_2326 (
    .A0(DISP0), .A1(DISP1), .A2(DISP2), .A3(DISP3), .E(1'b1), .D0(DISP0DEC0), .D1(DISP0DEC1),
    .D10(DISP0DEC10), .D11(DISP0DEC11), .D12(DISP0DEC12), .D13(DISP0DEC13), .D14(DISP0DEC14),
    .D15(DISP0DEC15), .D2(DISP0DEC2), .D3(DISP0DEC3), .D4(DISP0DEC4), .D5(DISP0DEC5), .D6(DISP0DEC6),
    .D7(DISP0DEC7), .D8(DISP0DEC8), .D9(DISP0DEC9));
  or XLXI_3075 (XLXN_15904, POS0P2CPCD15, POS0P2CPCD14, POS0P2CPCD13, POS0P2CPCD12, POS0P2CPCD11, POS0P2CPCD10, POS0P2CPCD9, POS0P2CPCD8, POS0P2CPCD7, POS0P2CPCD6, POS0P2CPCD5, POS0P2CPCD4, POS0P2CPCD3, POS0P2CPCD2, POS0P2CPCD1, POS0P2CPCD0);
  or XLXI_3076 (XLXN_15908, POS1P2CPCD15, POS1P2CPCD14, POS1P2CPCD13, POS1P2CPCD12, POS1P2CPCD11, POS1P2CPCD10, POS1P2CPCD9, POS1P2CPCD8, POS1P2CPCD7, POS1P2CPCD6, POS1P2CPCD5, POS1P2CPCD4, POS1P2CPCD3, POS1P2CPCD2, POS1P2CPCD1, POS1P2CPCD0);
  and XLXI_3115 (XLXN_15918, TESTINGPOS0, XLXN_15904);
  and XLXI_3118 (XLXN_15917, TESTINGPOS1, XLXN_15908);
  or XLXI_3121 (TESTPOSS, XLXN_15917, XLXN_15918);
  or XLXI_3149 (CODEDIG1FOUND, CODEDIG7, CODEDIG6, CODEDIG5, CODEDIG4);
  or XLXI_3150 (CODEDIG0FOUND, CODEDIG3, CODEDIG2, CODEDIG1, CODEDIG0);
  and XLXI_3151 (XLXN_12990, PSEL0, XLXN_13194);
  fd XLXI_3152 (.C(SYSCLK), .D(ACDDIGFOUND), .Q(XLXN_13194));
  fd4ce XLXI_3153 (
    .C(SYSCLK), .CE(XLXN_12990), .CLR(RESET), .D0(DISP0), .D1(DISP1), .D2(DISP2), .D3(DISP3), .Q0(CODEDIG0),
    .Q1(CODEDIG1), .Q2(CODEDIG2), .Q3(CODEDIG3));
  or XLXI_3154 (ACDDIGFOUND, CODERWD[3], CODERWD[4], CODERWD[5], CODERWD[6], CODERWD[7]);
  fd4ce XLXI_3155 (
    .C(SYSCLK), .CE(XLXN_12976), .CLR(RESET), .D0(DISP4), .D1(DISP5), .D2(DISP6), .D3(DISP7), .Q0(CODEDIG4),
    .Q1(CODEDIG5), .Q2(CODEDIG6), .Q3(CODEDIG7));
  and XLXI_3156 (XLXN_12976, PSEL1, XLXN_13219);
  fd XLXI_3157 (.C(SYSCLK), .D(ACDDIGFOUND), .Q(XLXN_13219));
  d4_16e XLXI_3159 (
    .A0(BRWD0), .A1(BRWD1), .A2(BRWD2), .A3(BRWD3), .E(1'b1), .D0(DECBRWD0), .D1(DECBRWD1), .D10(DECBRWD10),
    .D11(DECBRWD11), .D12(DECBRWD12), .D13(DECBRWD13), .D14(DECBRWD14), .D15(DECBRWD15), .D2(DECBRWD2),
    .D3(DECBRWD3), .D4(DECBRWD4), .D5(DECBRWD5), .D6(DECBRWD6), .D7(DECBRWD7), .D8(DECBRWD8), .D9(DECBRWD9));
  m4_1e XLXI_3172 (.D0(EQ1), .D1(EQ2), .D2(EQ3), .D3(1'b0), .E(1'b1), .S0(ENCPSEL0), .S1(ENCPSEL1), .O(XLXN_16325));
  m4_1e XLXI_3173 (.D0(1'b0), .D1(EQ0), .D2(EQ1), .D3(EQ2), .E(1'b1), .S0(ENCPSEL0), .S1(ENCPSEL1), .O(XLXN_16326));
  or XLXI_3174 (ADJPOSS, XLXN_16326, XLXN_16325);
  m2_1 XLXI_2546 (.D0(XLXN_14272), .D1(P1ACTPOSPLAY1), .S0(TESTING), .O(P1SEL1));
  or XLXI_2565 (XLXN_14272, P1ST4, P1ST0);
  or XLXI_2564 (XLXN_14275, P1ST5, P1ST1);
  m2_1 XLXI_2547 (.D0(XLXN_14275), .D1(P1ACTPOSPLAY2), .S0(TESTING), .O(P1SEL2));
  or XLXI_2566 (XLXN_14274, P1ST6, P1ST2);
  m2_1 XLXI_2548 (.D0(XLXN_14274), .D1(P1ACTPOSPLAY3), .S0(TESTING), .O(P1SEL3));
  or XLXI_2572 (XLXN_14273, P1ST6, P1ST5, P1ST4, P1ST3);
  m2_1 XLXI_2571 (.D0(XLXN_14273), .D1(P1ACTADD), .S0(TESTING), .O(P1ADD));
  m2_1 XLXI_2556 (.D0(XLXN_14271), .D1(P1ACTPOSPLAY0), .S0(TESTING), .O(XLXN_16486));
  or XLXI_2563 (XLXN_14271, P1ST3, P1ST0);
  or XLXI_3225 (P1SEL0, XLXN_16486, ACTDEFAULT);
  buf XLXI_3226 (P1PLAYED, PLAYING);
  m2_1 XLXI_3227 (.D0(R2D3), .D1(ACTCODE), .S0(SeeAction), .O(XLXN_16496));
  m2_1 XLXI_3228 (.D0(R2D2), .D1(ACTP2CODE), .S0(SeeAction), .O(XLXN_16510));
  m2_1 XLXI_3229 (.D0(R2D1), .D1(ACTADJ), .S0(SeeAction), .O(XLXN_16508));
  m2_1 XLXI_3230 (.D0(R2D0), .D1(ACTTEST), .S0(SeeAction), .O(XLXN_16511));
  obuf XLXI_1890 (.I(R1D0), .O(LED8));
  obuf XLXI_1889 (.I(R1D1), .O(LED9));
  obuf XLXI_1888 (.I(R1D2), .O(LED10));
  obuf XLXI_1887 (.I(XLXN_16512), .O(LED11));
  obuf XLXI_1886 (.I(XLXN_16511), .O(LED12));
  obuf XLXI_1885 (.I(XLXN_16508), .O(LED13));
  obuf XLXI_1884 (.I(XLXN_16510), .O(LED14));
  m2_1 XLXI_3239 (.D0(R1D3), .D1(ACTDEFAULT), .S0(SeeAction), .O(XLXN_16512));

  // Notes on the sheet:
  //   Control Signal Generation
  //   Next State Generation
  //   Latching Subsubblock
  //   Clock Signal Generation Subsubblock
  //   I/O PADs
  //   I/O BUFFER SUB-BLOCK
  //   Timing Subblock
  //   Debouncing Subsubblock
  //   7-Segment Digit Content Selection Subsubblock
  //   Display Subblock
  //   7-Segment Digit Control Subsubblock
  //   7-Segment Digit Selection Subsubblock
  //   Hex-to-7-Segment Converter Subsubblock
  //   Sequencing Subblock
  //   Information Gathering Subblock
  //   Decision Making Subblock
  //   Player's Points Storage Subsubblock
  //   Random Digit Generation Subsubblock
  //   Position Display Storage Subsubblock
  //   Points Display, Points Storage and Random Number Generation Subblock
  //   Display Add and Compare Subblock
  //   Adding RD to the Displays Subsubblock
  //   Code Storage and Code Reward Calculation Subsubblock
  //   Player 1-2 Multiplexing Subsubblock
  //   Select Digit to Store Subsubblock
  //   Select Compare Result Subsubblock
  //   Play Digit Determination Subblock
  //   Adjacency Subblock
  //   Encoded Adjacency Subsubblock
  //   Unencoded Adjacency Subsubblock
  //   Adjacent Similar Digit Subsubblock
  //   Equality Check Subsubblock
  //   Regular Reward Calculation Subblock
  //   Points Subblock
  //   Select Player Points Subblock
  //   POINTS ADDITION SUB-BLOCK
  //   Information Gathering Subblock
  //   I/O BUFFER SUB-BLOCK
  //   I/O PADs
endmodule
